# Altium project MB1189.PrjPCB (part 1 of 2)
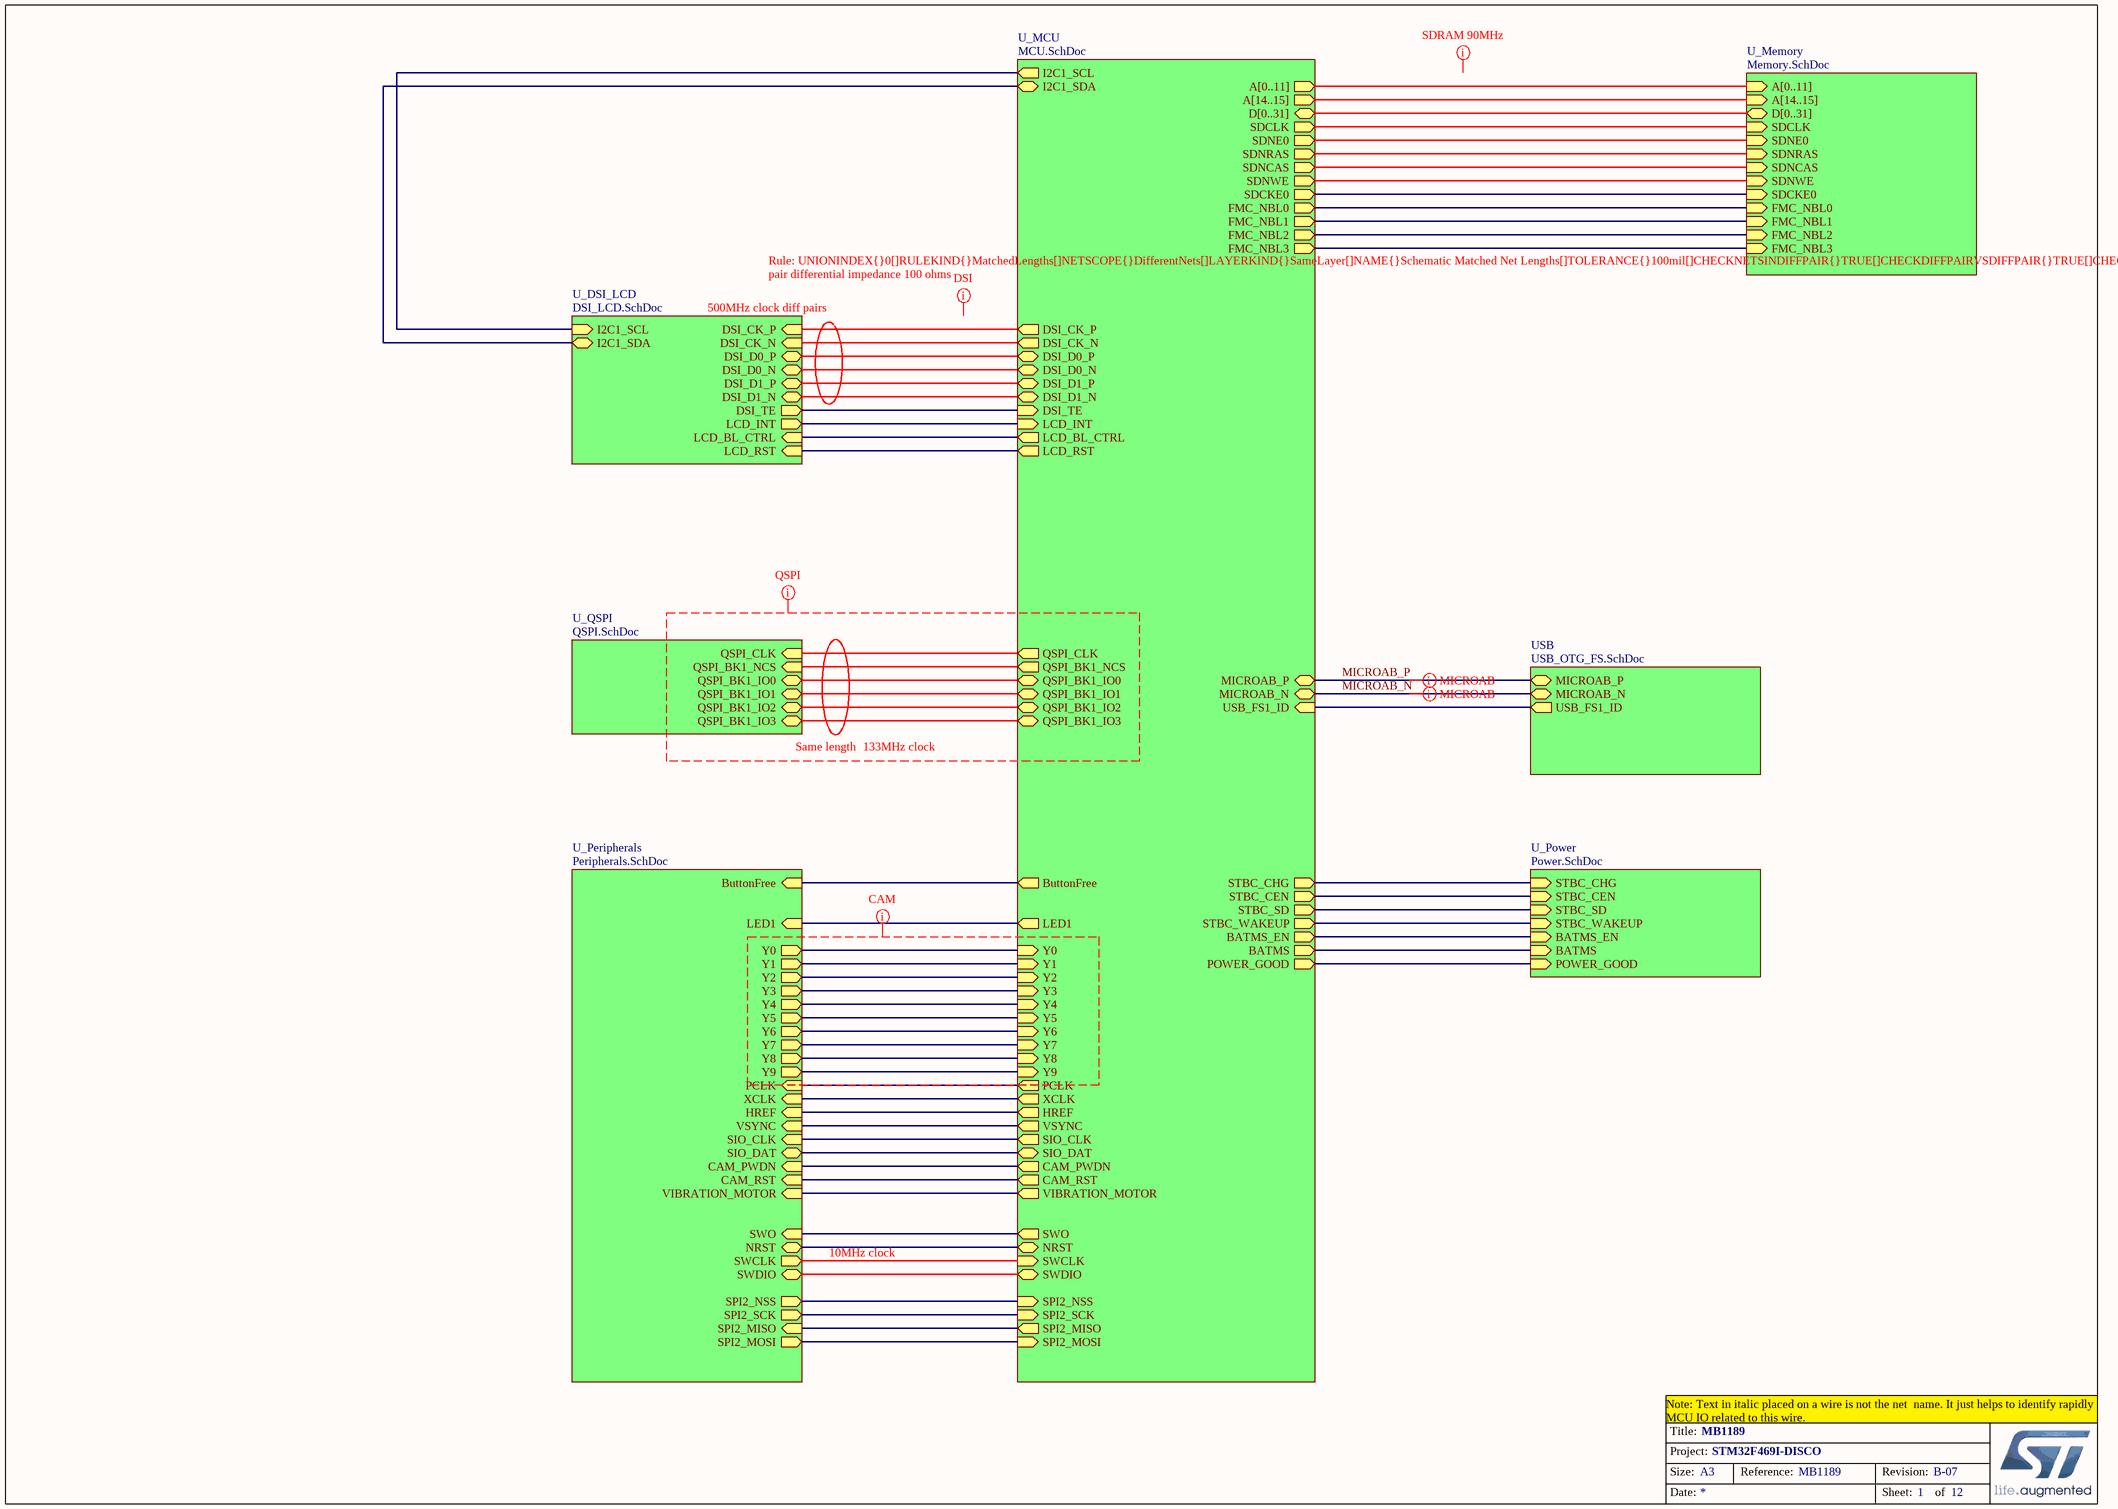
[diagram p0: MB1189.SchDoc]
8 sheets, 152 parts. Net scope: hierarchical (ports join the sheet entries above them; power ports are global).
Board files: MB1189.PcbDoc, trussy.PcbDoc
Sheets:
  MB1189.SchDoc
    U_Memory = Memory.SchDoc
    U_Peripherals = Peripherals.SchDoc
    U_Power = Power.SchDoc
    U_MCU = MCU.SchDoc
    U_DSI_LCD = DSI_LCD.SchDoc
    U_QSPI = QSPI.SchDoc
    USB = USB_OTG_FS.SchDoc

## Sheet MB1189.SchDoc: MB1189
size A3; Date: 9/24/2014; Author: P.A.; CompanyName: STMicroelectronics; Organization: Microcontrollers Division; Address1: 12, Rue Jules HOROWITZ; Address2: 38019 Grenoble; Address3: FRANCE; DocumentNumber: MB1189; Revision: B-07; SheetNumber: 1; SheetTotal: 12; Project: STM32F469I-DISCO

### Sub-sheets
U_DSI_LCD = DSI_LCD.SchDoc: DSI_CK_P (in), DSI_CK_N (in), DSI_D0_P (bidir), DSI_D0_N (bidir), DSI_D1_P (bidir), DSI_D1_N (bidir), DSI_TE (out), I2C1_SDA (bidir), I2C1_SCL (in), LCD_BL_CTRL (in), LCD_INT (out), LCD_RST (in)
U_MCU = MCU.SchDoc: LCD_BL_CTRL (out), I2C1_SCL (out), I2C1_SDA (bidir), FMC_NBL3 (out), FMC_NBL2 (out), FMC_NBL0 (out), FMC_NBL1 (out), SDNRAS (out), SDCLK (out), SDNCAS (out), SDCKE0 (out), SDNE0 (out), SDNWE (out), D[0..31] (bidir), QSPI_CLK (out), QSPI_BK1_NCS (out), QSPI_BK1_IO3 (bidir), QSPI_BK1_IO2 (bidir), QSPI_BK1_IO1 (bidir), QSPI_BK1_IO0 (bidir), DSI_TE (in), DSI_CK_P (out), DSI_CK_N (out), DSI_D0_P (bidir), DSI_D0_N (bidir), DSI_D1_P (bidir), DSI_D1_N (bidir), NRST (bidir), LCD_INT (in), LED1 (out), SWCLK (in), SWDIO, A[0..11] (out), A[14..15] (out), LCD_RST (out), STBC_CHG (out), STBC_CEN (out), STBC_WAKEUP (out), STBC_SD (out), BATMS (out), BATMS_EN (out), POWER_GOOD (out), Y0 (in), Y1 (in), Y2 (in), Y3 (in), Y4 (in), Y5 (in), Y6 (in), Y7 (in), Y8 (in), PCLK (out), VSYNC (out), XCLK (out), HREF (out), SIO_CLK (out), CAM_PWDN (out), SIO_DAT (bidir), VIBRATION_MOTOR (out), CAM_RST (out), MICROAB_P (bidir), MICROAB_N (bidir), USB_FS1_ID (in), SWO (out), Y9 (in), ButtonFree (out), SPI2_NSS (in), SPI2_MISO (out), SPI2_SCK (in), SPI2_MOSI (in)
U_Memory = Memory.SchDoc: FMC_NBL0 (in), FMC_NBL1 (in), D[0..31] (bidir), SDNCAS (in), SDNWE (in), SDNRAS (in), SDNE0 (in), SDCKE0 (in), SDCLK (in), FMC_NBL3 (in), FMC_NBL2 (in), A[0..11] (in), A[14..15] (in)
U_Peripherals = Peripherals.SchDoc: LED1 (in), Y0 (out), Y1 (out), Y2 (out), Y3 (out), Y4 (out), Y5 (out), Y6 (out), Y7 (out), Y8 (out), PCLK (in), VSYNC (in), XCLK (in), HREF (in), SIO_CLK (in), CAM_PWDN (in), SIO_DAT (bidir), VIBRATION_MOTOR (in), CAM_RST (in), SWDIO, SWCLK (out), NRST (bidir), SWO (in), Y9 (out), ButtonFree (in), SPI2_NSS (out), SPI2_MISO (in), SPI2_SCK (out), SPI2_MOSI (out)
U_Power = Power.SchDoc: STBC_CHG (in), STBC_CEN (in), STBC_WAKEUP (in), STBC_SD (in), BATMS (in), BATMS_EN (in), POWER_GOOD (in)
U_QSPI = QSPI.SchDoc: QSPI_BK1_IO0 (bidir), QSPI_BK1_IO2 (bidir), QSPI_BK1_IO1 (bidir), QSPI_CLK (in), QSPI_BK1_NCS (in), QSPI_BK1_IO3 (bidir)
USB = USB_OTG_FS.SchDoc: MICROAB_P (bidir), MICROAB_N (bidir), USB_FS1_ID (out)

### Nets
BATMS: sheet U_Power/BATMS, sheet U_MCU/BATMS
BATMS_EN: sheet U_Power/BATMS_EN, sheet U_MCU/BATMS_EN
CAM_PWDN: sheet U_Peripherals/CAM_PWDN, sheet U_MCU/CAM_PWDN
CAM_RST: sheet U_Peripherals/CAM_RST, sheet U_MCU/CAM_RST
DSI_CK_N: sheet U_MCU/DSI_CK_N, sheet U_DSI_LCD/DSI_CK_N
DSI_CK_P: sheet U_MCU/DSI_CK_P, sheet U_DSI_LCD/DSI_CK_P
DSI_D0_N: sheet U_MCU/DSI_D0_N, sheet U_DSI_LCD/DSI_D0_N
DSI_D0_P: sheet U_MCU/DSI_D0_P, sheet U_DSI_LCD/DSI_D0_P
DSI_D1_N: sheet U_MCU/DSI_D1_N, sheet U_DSI_LCD/DSI_D1_N
DSI_D1_P: sheet U_MCU/DSI_D1_P, sheet U_DSI_LCD/DSI_D1_P
DSI_TE: sheet U_MCU/DSI_TE, sheet U_DSI_LCD/DSI_TE
HREF: sheet U_Peripherals/HREF, sheet U_MCU/HREF
I2C1_SCL: sheet U_MCU/I2C1_SCL, sheet U_DSI_LCD/I2C1_SCL
I2C1_SDA: sheet U_MCU/I2C1_SDA, sheet U_DSI_LCD/I2C1_SDA
LCD_BL_CTRL: sheet U_MCU/LCD_BL_CTRL, sheet U_DSI_LCD/LCD_BL_CTRL
LCD_INT: sheet U_MCU/LCD_INT, sheet U_DSI_LCD/LCD_INT
LCD_RST: sheet U_MCU/LCD_RST, sheet U_DSI_LCD/LCD_RST
LED1: sheet U_Peripherals/LED1, sheet U_MCU/LED1
MICROAB_N: sheet U_MCU/MICROAB_N, sheet USB/MICROAB_N
MICROAB_P: sheet U_MCU/MICROAB_P, sheet USB/MICROAB_P
NRST: sheet U_Peripherals/NRST, sheet U_MCU/NRST
PB6: sheet U_MCU/QSPI_BK1_NCS, sheet U_QSPI/QSPI_BK1_NCS
PC0: sheet U_Memory/SDNWE, sheet U_MCU/SDNWE
PCLK: sheet U_Peripherals/PCLK, sheet U_MCU/PCLK
PE0: sheet U_Memory/FMC_NBL0, sheet U_MCU/FMC_NBL0
PE1: sheet U_Memory/FMC_NBL1, sheet U_MCU/FMC_NBL1
PF6: sheet U_MCU/QSPI_BK1_IO3, sheet U_QSPI/QSPI_BK1_IO3
PF7: sheet U_MCU/QSPI_BK1_IO2, sheet U_QSPI/QSPI_BK1_IO2
PF8: sheet U_MCU/QSPI_BK1_IO0, sheet U_QSPI/QSPI_BK1_IO0
PF9: sheet U_MCU/QSPI_BK1_IO1, sheet U_QSPI/QSPI_BK1_IO1
PF10: sheet U_MCU/QSPI_CLK, sheet U_QSPI/QSPI_CLK
PF11: sheet U_Memory/SDNRAS, sheet U_MCU/SDNRAS
PG15: sheet U_Memory/SDNCAS, sheet U_MCU/SDNCAS
PH2: sheet U_Memory/SDCKE0, sheet U_MCU/SDCKE0
PH3: sheet U_Memory/SDNE0, sheet U_MCU/SDNE0
PI4: sheet U_Memory/FMC_NBL2, sheet U_MCU/FMC_NBL2
PI5: sheet U_Memory/FMC_NBL3, sheet U_MCU/FMC_NBL3
POWER_GOOD: sheet U_Power/POWER_GOOD, sheet U_MCU/POWER_GOOD
SIO_CLK: sheet U_Peripherals/SIO_CLK, sheet U_MCU/SIO_CLK
SIO_DAT: sheet U_Peripherals/SIO_DAT, sheet U_MCU/SIO_DAT
SPI2_MISO: sheet U_Peripherals/SPI2_MISO, sheet U_MCU/SPI2_MISO
SPI2_MOSI: sheet U_Peripherals/SPI2_MOSI, sheet U_MCU/SPI2_MOSI
SPI2_NSS: sheet U_Peripherals/SPI2_NSS, sheet U_MCU/SPI2_NSS
SPI2_SCK: sheet U_Peripherals/SPI2_SCK, sheet U_MCU/SPI2_SCK
STBC_CEN: sheet U_Power/STBC_CEN, sheet U_MCU/STBC_CEN
STBC_CHG: sheet U_Power/STBC_CHG, sheet U_MCU/STBC_CHG
STBC_SD: sheet U_Power/STBC_SD, sheet U_MCU/STBC_SD
STBC_WAKEUP: sheet U_Power/STBC_WAKEUP, sheet U_MCU/STBC_WAKEUP
SWCLK: sheet U_Peripherals/SWCLK, sheet U_MCU/SWCLK
SWDIO: sheet U_Peripherals/SWDIO, sheet U_MCU/SWDIO
VIBRATION_MOTOR: sheet U_Peripherals/VIBRATION_MOTOR, sheet U_MCU/VIBRATION_MOTOR
VSYNC: sheet U_Peripherals/VSYNC, sheet U_MCU/VSYNC
XCLK: sheet U_Peripherals/XCLK, sheet U_MCU/XCLK
Y0: sheet U_Peripherals/Y0, sheet U_MCU/Y0
Y1: sheet U_Peripherals/Y1, sheet U_MCU/Y1
Y2: sheet U_Peripherals/Y2, sheet U_MCU/Y2
Y3: sheet U_Peripherals/Y3, sheet U_MCU/Y3
Y4: sheet U_Peripherals/Y4, sheet U_MCU/Y4
Y5: sheet U_Peripherals/Y5, sheet U_MCU/Y5
Y6: sheet U_Peripherals/Y6, sheet U_MCU/Y6
Y7: sheet U_Peripherals/Y7, sheet U_MCU/Y7
Y8: sheet U_Peripherals/Y8, sheet U_MCU/Y8
Y9: sheet U_Peripherals/Y9, sheet U_MCU/Y9
NetCN1_1: sheet U_Peripherals/SWO, sheet U_MCU/SWO
NetR8_2: sheet U_Peripherals/ButtonFree, sheet U_MCU/ButtonFree
NetR161_2: sheet U_MCU/USB_FS1_ID, sheet USB/USB_FS1_ID
NetU4_J1: sheet U_Memory/SDCLK, sheet U_MCU/SDCLK

### Buses and harness runs
bus sheet U_MCU/A[0..11] = sheet U_Memory/A[0..11]
bus sheet U_MCU/A[14..15] = sheet U_Memory/A[14..15]
bus sheet U_MCU/D[0..31] = sheet U_Memory/D[0..31]

### Layout directives
mark named SDRAM 90MHz: (no net found under the mark)
rule Matched Net Lengths [Tolerance = 100mil]; rule ? : (no net found under the mark)
differential pair: MICROAB_N, MICROAB_P
net class Cam: (no net found under the mark)
net class QSPI: (no net found under the mark)

### Notes on the sheet
- 500MHz clock diff pairs
- Same length
- 133MHz clock
- 10MHz clock
- Note: Text in italic placed on a wire is not the net  name. It just helps to identify rapidly MCU IO related to this wire.
- Title:
- Project:
- Size:
- Date:
- A3
- Reference:
- Sheet:
- Revision:
- of

## Sheet Memory.SchDoc: SDRAM
size A4; Date: 9/24/2014; Author: P.A.; CompanyName: STMicroelectronics; Organization: Microcontrollers Division; Address1: 12, Rue Jules HOROWITZ; Address2: 38019 Grenoble; Address3: FRANCE; DocumentNumber: MB1189; Revision: B-07; SheetNumber: 8; SheetTotal: 12; Project: STM32F469I-DISCO
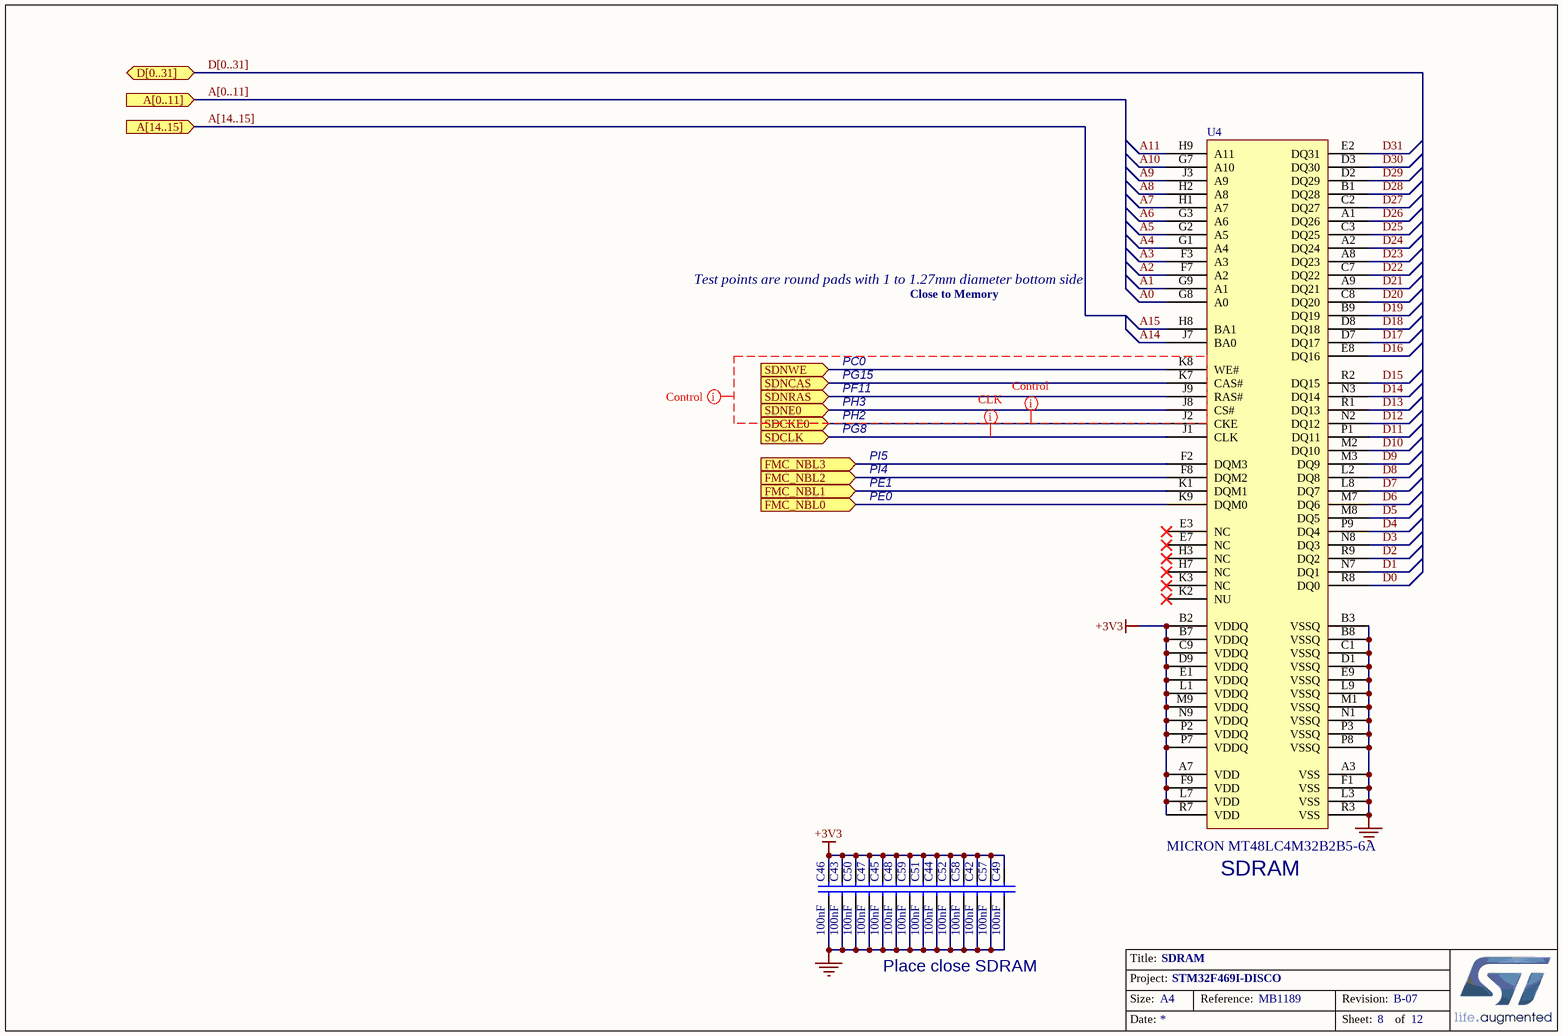
[diagram p1: Memory.SchDoc]

### Parts
C42  100nF  [CAP - 0402]
C43  100nF  [CAP - 0402]
C44  100nF  [CAP - 0402]
C45  100nF  [CAP - 0402]
C46  100nF  [CAP - 0402]
C47  100nF  [CAP - 0402]
C48  100nF  [CAP - 0402]
C49  100nF  [CAP - 0402]
C50  100nF  [CAP - 0402]
C51  100nF  [CAP - 0402]
C52  100nF  [CAP - 0402]
C57  100nF  [CAP - 0402]
C58  100nF  [CAP - 0402]
C59  100nF  [CAP - 0402]
U4  MICRON MT48LC4M32B2B5-6A  [MICT-B5-90]

### Ports
A[0..11] (in), A[14..15] (in), D[0..31] (bidir), FMC_NBL0 (in), FMC_NBL1 (in), FMC_NBL2 (in), FMC_NBL3 (in), SDCKE0 (in), SDCLK (in), SDNCAS (in), SDNE0 (in), SDNRAS (in), SDNWE (in)

### Nets
+3V3: C42.1 C43.1 C44.1 C45.1 C46.1 C47.1 C48.1 C49.1 C50.1 C51.1 C52.1 C57.1 C58.1 C59.1 U4.A7(VDD) U4.B2(VDDQ) U4.B7(VDDQ) U4.C9(VDDQ) U4.D9(VDDQ) U4.E1(VDDQ) U4.F9(VDD) U4.L1(VDDQ) U4.L7(VDD) U4.M9(VDDQ) U4.N9(VDDQ) U4.P2(VDDQ) U4.P7(VDDQ) U4.R7(VDD)
GND: C42.2 C43.2 C44.2 C45.2 C46.2 C47.2 C48.2 C49.2 C50.2 C51.2 C52.2 C57.2 C58.2 C59.2 U4.A3(VSS) U4.B3(VSSQ) U4.B8(VSSQ) U4.C1(VSSQ) U4.D1(VSSQ) U4.E9(VSSQ) U4.F1(VSS) U4.L3(VSS) U4.L9(VSSQ) U4.M1(VSSQ) U4.N1(VSSQ) U4.P3(VSSQ) U4.P8(VSSQ) U4.R3(VSS)
A0: U4.G8(A0)
A1: U4.G9(A1)
A2: U4.F7(A2)
A3: U4.F3(A3)
A4: U4.G1(A4)
A5: U4.G2(A5)
A6: U4.G3(A6)
A7: U4.H1(A7)
A8: U4.H2(A8)
A9: U4.J3(A9)
A10: U4.G7(A10)
A11: U4.H9(A11)
A14: U4.J7(BA0)
A15: U4.H8(BA1)
D0: U4.R8(DQ0)
D1: U4.N7(DQ1)
D2: U4.R9(DQ2)
D3: U4.N8(DQ3)
D4: U4.P9(DQ4)
D5: U4.M8(DQ5)
D6: U4.M7(DQ6)
D7: U4.L8(DQ7)
D8: U4.L2(DQ8)
D9: U4.M3(DQ9)
D10: U4.M2(DQ10)
D11: U4.P1(DQ11)
D12: U4.N2(DQ12)
D13: U4.R1(DQ13)
D14: U4.N3(DQ14)
D15: U4.R2(DQ15)
D16: U4.E8(DQ16)
D17: U4.D7(DQ17)
D18: U4.D8(DQ18)
D19: U4.B9(DQ19)
D20: U4.C8(DQ20)
D21: U4.A9(DQ21)
D22: U4.C7(DQ22)
D23: U4.A8(DQ23)
D24: U4.A2(DQ24)
D25: U4.C3(DQ25)
D26: U4.A1(DQ26)
D27: U4.C2(DQ27)
D28: U4.B1(DQ28)
D29: U4.D2(DQ29)
D30: U4.D3(DQ30)
D31: U4.E2(DQ31)
PC0: U4.K8(WE#) ; port SDNWE
PE0: U4.K9(DQM0) ; port FMC_NBL0
PE1: U4.K1(DQM1) ; port FMC_NBL1
PF11: U4.J9(RAS#) ; port SDNRAS
PG15: U4.K7(CAS#) ; port SDNCAS
PH2: U4.J2(CKE) ; port SDCKE0
PH3: U4.J8(CS#) ; port SDNE0
PI4: U4.F8(DQM2) ; port FMC_NBL2
PI5: U4.F2(DQM3) ; port FMC_NBL3
NetU4_J1: U4.J1(CLK) ; port SDCLK

Not connected (* = marked no-connect by the designer): U4 E3(NC)* E7(NC)* H3(NC)* H7(NC)* K2(NU)* K3(NC)*

### Buses and harness runs
bus A[0..11] = port A[0..11]
bus A[14..15] = port A[14..15]
bus D[0..31] = port D[0..31]

### Layout directives
net class Control: (no net found under the mark), PH2
net class CLK: NetU4_J1

### Notes on the sheet
- (near U4) Test points are round pads with 1 to 1.27mm diameter bottom side
- Close to Memory
- PC0
- PG15
- PF11
- PH3
- PH2
- PG8
- PE1
- PE0
- PI5
- PI4
- (near U4) SDRAM
- Place close SDRAM
- Title:
- Project:
- Size:
- Date:
- A4
- Reference:
- Sheet:
- Revision:
- of

### Library data of the parts
C42-C52 C57-C59 = Cap: Capacitor; Value: 10nF; Ordered by: Subcon; Published: 8-Jun-2000; Revision: July-2002: Re-released for DXP Platform.; Publisher: Altium Limited
U4 = MT48LC4M32B2B5: Ordered by: Subcon; ECCN_US/EU: EAR99/NEC; Manuf_1: MICRON; Manuf_Part_1: MT48LC4M32B2B5-6A

## Sheet Peripherals.SchDoc: Peripherals
size A4; Date: 9/24/2014; Author: P.A.; CompanyName: STMicroelectronics; Organization: Microcontrollers Division; Address1: 12, Rue Jules HOROWITZ; Address2: 38019 Grenoble; Address3: FRANCE; DocumentNumber: MB1189; Revision: B-07; SheetNumber: 5; SheetTotal: 12; Project: STM32F469I-DISCO
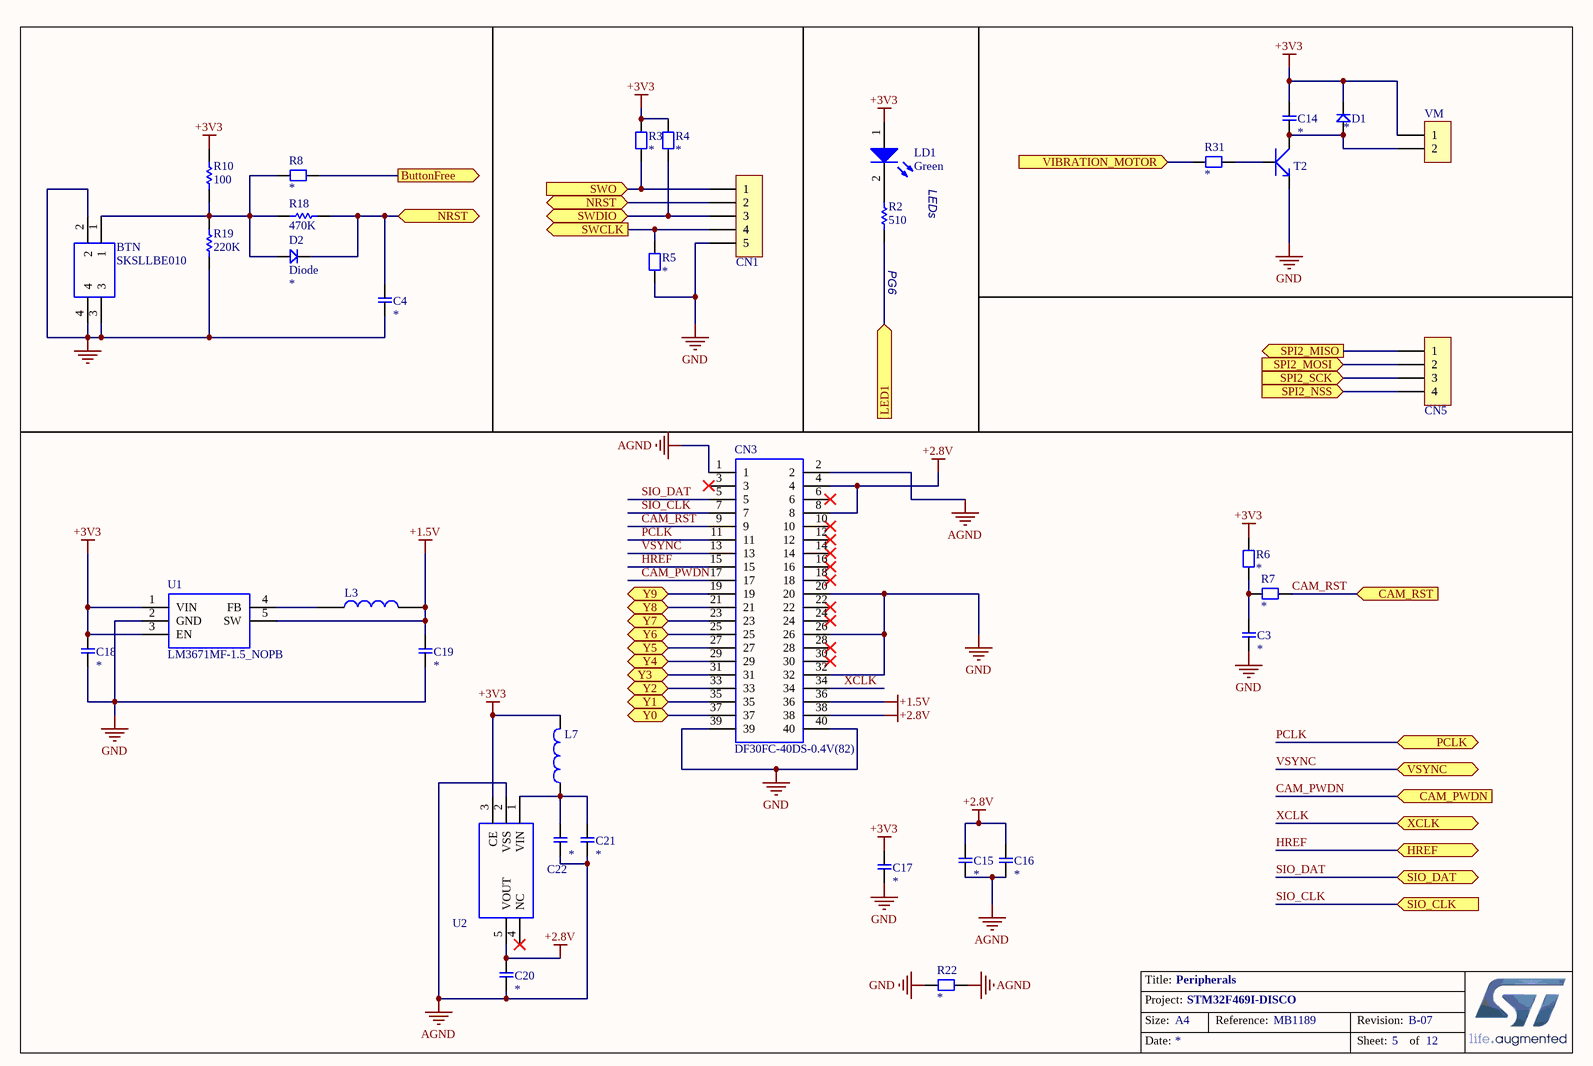
[diagram p2: Peripherals.SchDoc]

### Parts
BTN  SKSLLBE010  [SKSLLBE010]
C3  100 nF  [CAP - 0402]  (value not drawn)
C4  10uF  [CAP - 0805]  (value not drawn)
C14  100nF  [CAP - 0402]  (value not drawn)
C15  100nF  [CAP - 0402]  (value not drawn)
C16  100nF  [CAP - 0402]  (value not drawn)
C17  100nF  [CAP - 0402]  (value not drawn)
C18  4.7 uF  [CAP - 0603]  (value not drawn)
C19  10 uF  [CAP - 0402]  (value not drawn)
C20  1uF  [CAP - 0402]  (value not drawn)
C21  100nF  [CAP - 0402]  (value not drawn)
C22  10uF  [CAP - 0402]  (value not drawn)
CN1  Pin header 5p  [PIN HEADER 5P 2.54mm]  (value not drawn)
CN3  DF30FC-40DS-0.4V(82)  [DF30FC40DS04V82]
CN5  Pin header 4p  [Pin header 4p 1.27mm]  (value not drawn)
D1  Diode  [SOD123]  (value not drawn)
D2  Diode  [SOD123]
L3  2.2uH  [INDPM4532X280N]  (value not drawn)
L7  BEAD(BK1608HS600-T)  [1608[0603]]  (value not drawn)
LD1  Green  [LEDC1608X55N]
R2  510  [RES - 0402]
R3  4K7  [RES - 0402]  (value not drawn)
R4  4K7  [RES - 0402]  (value not drawn)
R5  47K  [RES - 0402]  (value not drawn)
R6  4K7  [RES - 0402]  (value not drawn)
R7  0R  [RES - 0402]  (value not drawn)
R8  10  [RES - 0402]  (value not drawn)
R10  100  [RES - 0402]
R18  470K  [RES - 0603]
R19  220K  [RES - 0402]
R22  0R  [RES - 0402]  (value not drawn)
R31  1K  [RES - 0402]  (value not drawn)
T2  BC817  [SOT23]  (value not drawn)
U1  LM3671MF-1.5_NOPB  [SOT95P280X145-5N]
U2  AP7365-28WG-7DICT-ND  [SOT95P280X120-5N]  (value not drawn)
VM  Pin header 2p  [RES - 0603]  (value not drawn)

### Ports
ButtonFree (out), CAM_PWDN (in), CAM_RST (in), HREF, LED1 (in), NRST (bidir), PCLK, SIO_CLK (in), SIO_DAT (bidir), SPI2_MISO (out), SPI2_MOSI (in), SPI2_NSS (in), SPI2_SCK (in), SWCLK (out), SWDIO (bidir), SWO (in), VIBRATION_MOTOR (in), VSYNC, XCLK, Y0, Y1, Y2, Y3, Y4, Y5, Y6, Y7, Y8, Y9

### Nets
+1.5V: C19.2 CN3.36 L3.2 U1.5(SW)
+2.8V: C15.1 C16.1 C20.1 CN3.4 CN3.8 CN3.38 U2.5(VOUT)
+3V3: C14.2 C17.1 C18.2 D1.2 L7.2 LD1.1(A) R3.2 R4.2 R6.2 R10.2 U1.1(VIN) U1.3(EN) U2.3(CE) VM.1
AGND: C15.2 C16.2 C20.2 C21.2 C22.2 CN3.1 CN3.2 R22.1 U2.2(VSS)
GND: BTN.2 BTN.3 BTN.4 C3.2 C4.1 C17.2 C18.1 C19.1 CN1.5 CN3.20 CN3.26 CN3.32 CN3.39 CN3.40 R5.1 R19.2 R22.2 T2.2 U1.2(GND)
CAM_PWDN: CN3.17 ; port CAM_PWDN
CAM_RST: CN3.9 R7.1 ; port CAM_RST
HREF: CN3.15 ; port HREF
LED1: R2.1 ; port LED1
NRST: C4.2 CN1.2 D2.2 R18.2 ; port NRST
PCLK: CN3.11 ; port PCLK
SIO_CLK: CN3.7 ; port SIO_CLK
SIO_DAT: CN3.5 ; port SIO_DAT
SPI2_MISO: CN5.1 ; port SPI2_MISO
SPI2_MOSI: CN5.2 ; port SPI2_MOSI
SPI2_NSS: CN5.4 ; port SPI2_NSS
SPI2_SCK: CN5.3 ; port SPI2_SCK
SWCLK: CN1.4 R5.2 ; port SWCLK
SWDIO: CN1.3 R4.1 ; port SWDIO
VIBRATION_MOTOR: R31.2 ; port VIBRATION_MOTOR
VSYNC: CN3.13 ; port VSYNC
XCLK: CN3.34 ; port XCLK
Y0: CN3.37 ; port Y0
Y1: CN3.35 ; port Y1
Y2: CN3.33 ; port Y2
Y3: CN3.31 ; port Y3
Y4: CN3.29 ; port Y4
Y5: CN3.27 ; port Y5
Y6: CN3.25 ; port Y6
Y7: CN3.23 ; port Y7
Y8: CN3.21 ; port Y8
Y9: CN3.19 ; port Y9
NetBTN_1: BTN.1 D2.1 R8.1 R10.1 R18.1 R19.1
NetC3_1: C3.1 R6.1 R7.2
NetC14_1: C14.1 D1.1 T2.3 VM.2
NetC21_1: C21.1 C22.1 L7.1 U2.1(VIN)
NetCN1_1: CN1.1 R3.1 ; port SWO
NetL3_1: L3.1 U1.4(FB)
NetLD1_2: LD1.2(K) R2.2
NetR8_2: R8.2 ; port ButtonFree
NetR31_1: R31.1 T2.1

Not connected (* = marked no-connect by the designer): CN3 3* 6* 10* 12* 14* 16* 18* 22* 24* 28* 30*; U2 4(NC)*

### Notes on the sheet
- LEDs
- (near R2) PG6
- Title:
- Project:
- Size:
- Date:
- A4
- Reference:
- Sheet:
- Revision:
- of

### Library data of the parts
BTN = SKSLLBE010: Black Button Tactile Switch, SPST-NO 50 mA 0.5mm Surface Mount; Manufacturer_Name: ALPS; Geometry.Height: 2mm; Mouser Part Number: 688-SKSLLBE010; Manufacturer_Part_Number: SKSLLBE010; Datasheet Link: https://componentsearchengine.com/Datasheets/1/SKSLLBE010.pdf
C3 C4 C14-C22 = capacitor: Parameter 1: *; Parameter 2: *; Value: *
CN3 = DF30FC-40DS-0.4V(82): Hirose DF30 Series 0.4mm 40 Way 2 Row Straight PCB Socket Surface Mount Board to Board, Board to FPC; Geometry.Height: 1.05mm; Manufacturer_Name: Hirose; Manufacturer_Part_Number: DF30FC-40DS-0.4V(82); RS Part Number: 7008159; RS Price/Stock: http://uk.rs-online.com/web/p/products/7008159; Arrow Part Number: DF30FC-40DS-0.4V(82); Arrow Price/Stock: http://uk.rs-online.com/web/p/products/7008159; Datasheet Link: https://www.hirose.com/product/en/download_file/key_name/DF30FC-40DS-0.4V%2882%29/category/Drawing%20(2D)/doc_file_id/46399/?file_category_id=6&item_id=06841078682&is_series=
L3 = LQH43CN100K03L: 587-3550-1-ND; Manufacturer_Name: Murata Electronics; Geometry.Height: 2.8mm; Manufacturer_Part_Number: LQH43CN100K03L; RS Part Number: 7255165P; RS Price/Stock: http://uk.rs-online.com/web/p/products/7255165P; Arrow Part Number: LQH43CN100K03L; Arrow Price/Stock: https://www.arrow.com/en/products/lqh43cn100k03l/murata-manufacturing; Datasheet Link: http://search.murata.co.jp/Ceramy/image/img/PDF/ENG/L0075S0093LQH43C_03.pdf
L7 = Inductor: Code_IEC: 1005; Value: 10mH; Published: 8-Jun-2000; LatestRevisionDate: 29-May-2009; LatestRevisionNote: IPC-7351 Footprint Added.; PackageReference: 0402-A; Publisher: Altium Limited; PackageDescription: Chip Inductor; Code_JEITA: 0402
LD1 = LED2: Typical RED, GREEN, YELLOW, AMBER GaAs LED; Ordered by: Subcon; ECCN_US/EU: EAR99/NEC; Published: 8-Jun-2000; Revision: July-2002: Re-released for DXP Platform.; Publisher: Altium Limited
R2 R10 R18 = Res1: Resistor; Value: 1K; Ordered by: Subcon; Published: 8-Jun-2000; Revision: July-2002: Re-released for DXP Platform.; Publisher: Altium Limited
R3-R8 R22 R31 = resistor: Parameter 1: *; Parameter 2: *; Value: *
R19 = res1: Resistor; Value: 1K; Ordered by: Subcon; Published: 8-Jun-2000; Revision: July-2002: Re-released for DXP Platform.; Publisher: Altium Limited
U1 = LM3671MF-1.5_NOPB: 2MHz, 600mA Step-Down DC-DC Converter; Manufacturer_Name: Texas Instruments; Manufacturer_Part_Number: LM3671MF-1.5/NOPB; Geometry.Height: 1.45mm; RS Part Number: 1624720; RS Price/Stock: http://uk.rs-online.com/web/p/products/1624720; Arrow Part Number: LM3671MF-1.5/NOPB; Arrow Price/Stock: https://www.arrow.com/en/products/lm3671mf-1.5nopb/texas-instruments; Datasheet Link: http://www.ti.com/lit/ds/symlink/lm3671.pdf
U2 = XC6210B302MR-G: LDO Voltage Regulators 700mA High Speed Votage Regulator; Manufacturer_Name: Torex; Geometry.Height: 1.2mm; Manufacturer_Part_Number: XC6210B302MR-G; RS Part Number: *; RS Price/Stock: *; Arrow Part Number: XC6210B302MR-G; Arrow Price/Stock: *; Datasheet Link: https://componentsearchengine.com/Datasheets/1/XC6210B302MR-G.pdf
D1 D2 = Diode: Type: *

## Sheet Power.SchDoc: Power
size A4; Date: 9/24/2014; Author: P.A.; CompanyName: STMicroelectronics; Organization: Microcontrollers Division; Address1: 12, Rue Jules HOROWITZ; Address2: 38019 Grenoble; Address3: FRANCE; DocumentNumber: MB1189; Revision: B-07; SheetNumber: 4; SheetTotal: 12; Project: STM32F469I-DISCO
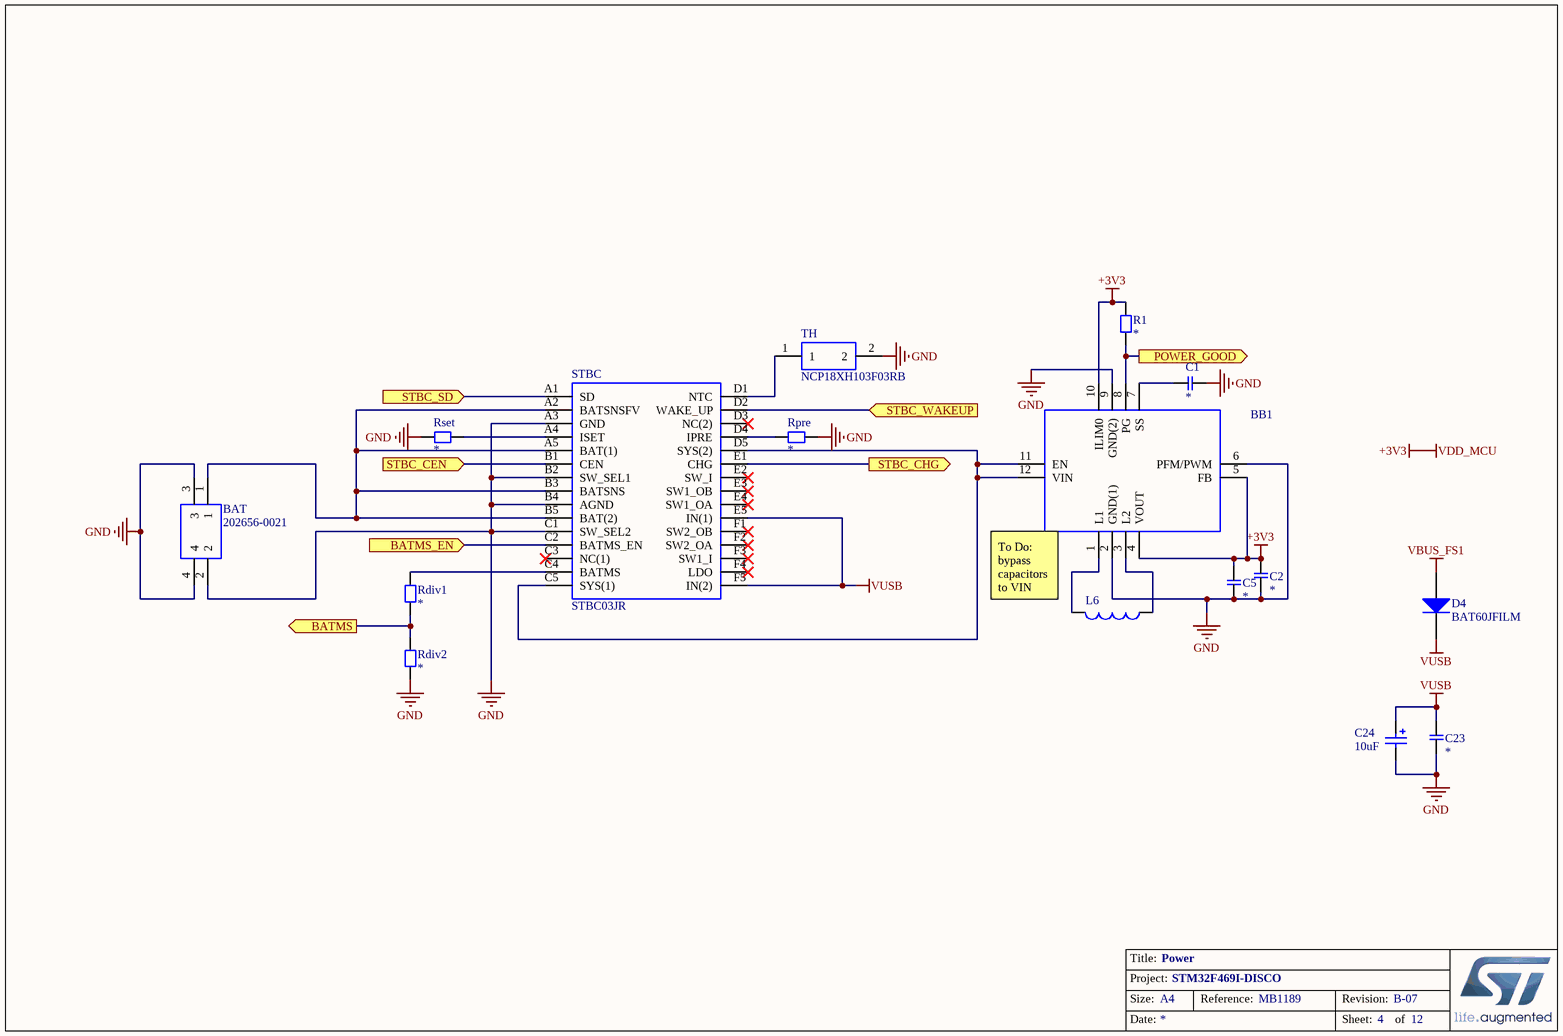
[diagram p3: Power.SchDoc]

### Parts
BAT  202656-0021  [2026560021]
BB1  TPS63051RMWT  [QFN50P250X250X100-12N-D]  (value not drawn)
C1  1nF  [CAP - 0402]  (value not drawn)
C2  10uF  [CAP - 0402]  (value not drawn)
C5  100nF  [CAP - 0402]  (value not drawn)
C23  10uF  [CAP - 0402]  (value not drawn)
C24  10uF  [A]
D4  BAT60JFILM  [SOD323]
L6  1269AS-H-1R5M=P2  [INDC2928X203N]  (value not drawn)
R1  1M  [RES - 1206]  (value not drawn)
Rdiv1  100k  [RES - 0402]  (value not drawn)
Rdiv2  200K  [RES - 0402]  (value not drawn)
Rpre  1K  [RES - 0402]  (value not drawn)
Rset  430 Ohm  [RES - 0402]  (value not drawn)
STBC  STBC03JR  [BGA30C40P5X6_225X259X60]
TH  NCP18XH103F03RB  [THRMC1608X95N]

### Ports
BATMS (out), BATMS_EN (in), POWER_GOOD (out), STBC_CEN (in), STBC_CHG (out), STBC_SD (in), STBC_WAKEUP (in)

### Nets
+3V3: BB1.4(VOUT) BB1.5(FB) BB1.10(ILIM0) C2.1 C5.1 R1.1  [also labelled VDD_MCU]
GND: BAT.2 BAT.3 BAT.4 BB1.2(GND(1)) BB1.6(PFM/PWM) BB1.9(GND(2)) C1.2 C2.2 C5.2 C23.2 C24.2 Rdiv2.1 Rpre.1 Rset.2 STBC.A3(GND) STBC.B2(SW_SEL1) STBC.B4(AGND) STBC.C1(SW_SEL2) TH.2
VBUS_FS1: D4.1(A)
VUSB: C23.1 C24.1 D4.2(K) STBC.E5(IN(1)) STBC.F5(IN(2))
BATMS: Rdiv1.1 Rdiv2.2 ; port BATMS
BATMS_EN: STBC.C2(BATMS_EN) ; port BATMS_EN
POWER_GOOD: BB1.8(PG) R1.2 ; port POWER_GOOD
STBC_CEN: STBC.B1(CEN) ; port STBC_CEN
STBC_CHG: STBC.E1(CHG) ; port STBC_CHG
STBC_SD: STBC.A1(SD) ; port STBC_SD
STBC_WAKEUP: STBC.D2(WAKE_UP) ; port STBC_WAKEUP
NetBAT_1: BAT.1 STBC.A2(BATSNSFV) STBC.A5(BAT(1)) STBC.B3(BATSNS) STBC.B5(BAT(2))
NetBB1_1: BB1.1(L1) L6.2
NetBB1_3: BB1.3(L2) L6.1
NetBB1_7: BB1.7(SS) C1.1
NetBB1_11: BB1.11(EN) BB1.12(VIN) STBC.C5(SYS(1)) STBC.D5(SYS(2))
NetRdiv1_2: Rdiv1.2 STBC.C4(BATMS)
NetRpre_2: Rpre.2 STBC.D4(IPRE)
NetRset_1: Rset.1 STBC.A4(ISET)
NetSTBC_D1: STBC.D1(NTC) TH.1

Not connected (* = marked no-connect by the designer): STBC C3(NC(1))* D3(NC(2))* E2(SW_I)* E3(SW1_OB)* E4(SW1_OA)* F1(SW2_OB)* F2(SW2_OA)* F3(SW1_I)* F4(LDO)*

### Notes on the sheet
- (near BB1) To Do: bypass capacitors to VIN
- Title:
- Project:
- Size:
- Date:
- A4
- Reference:
- Sheet:
- Revision:
- of

### Library data of the parts
BAT = 202656-0021: MOLEX - 202656-0021 - PLUG HOUSING, 2POS, NYLON, BLACK; Geometry.Height: 1mm; Manufacturer_Name: Molex; Manufacturer_Part_Number: 202656-0021; RS Part Number: *; RS Price/Stock: *; Mouser Part Number: 538-202656-0021; Mouser Price/Stock: https://www.mouser.com/Search/Refine.aspx?Keyword=538-202656-0021; Datasheet Link: https://www.molex.com/webdocs/datasheets/pdf/en-us/2026560021_PCB_HEADERS.pdf
BB1 = TPS63051RMWT: Switching Voltage Regulators Tiny Single Ind Buck Boost Convter; Manufacturer_Name: Texas Instruments; Geometry.Height: 1mm; Manufacturer_Part_Number: TPS63051RMWT; RS Part Number: *; RS Price/Stock: *; Datasheet Link: http://www.ti.com/general/docs/lit/getliterature.tsp?genericPartNumber=TPS63051&&fileType=pdf
C1 C2 C5 C23 = capacitor: Parameter 1: *; Parameter 2: *; Value: *
C24 = Cap Pol1: Polarized Capacitor (Radial); Ordered by: Subcon; Published: 8-Jun-2000; Revision: July-2002: Re-released for DXP Platform.; Publisher: Altium Limited; Value: 10uF
D4 = BAT60JFILM: Provided: ST; ECCN_US/EU: EAR99/NEC; Ref St: 9151097; Revision: July-2002: Re-released for DXP Platform.; Order: BAT60JFILM; Manuf_Part_1: BAT60JFILM; Manuf_1: ST; Distrib: ST; Ordered by: ST
L6 = Inductor: Code_IEC: 1005; Value: 10mH; Published: 8-Jun-2000; LatestRevisionDate: 29-May-2009; LatestRevisionNote: IPC-7351 Footprint Added.; PackageReference: 0402-A; Publisher: Altium Limited; PackageDescription: Chip Inductor; Code_JEITA: 0402
R1 Rdiv1 Rdiv2 Rpre Rset = resistor: Parameter 1: *; Parameter 2: *; Value: *
STBC = STBC03JR: STMICROELECTRONICS - STBC03JR - BATTERY CHARGER, LI-ION/POL, FLIPCHIP-30; Geometry.Height: 0.6mm; Manufacturer_Name: STMicroelectronics; Manufacturer_Part_Number: STBC03JR; RS Part Number: *; RS Price/Stock: *; Datasheet Link: http://www.st.com/content/ccc/resource/technical/document/datasheet/group3/05/ea/e8/4e/a7/a6/4a/c6/DM00338132/files/DM00338132.pdf/jcr:content/translations/en.DM00338132.pdf
TH = NCP18XH103F03RB: Thermistor NTC 10K Ohm 1% 2-Pin 0603 Surface Mount Solder Pad 3434K T/R; Manufacturer_Name: Murata Electronics; Geometry.Height: 0.95mm; Manufacturer_Part_Number: NCP18XH103F03RB; RS Part Number: 7259057P; RS Price/Stock: http://uk.rs-online.com/web/p/products/7259057P; Mouser Part Number: 81-NCP18XH103F03RB; Mouser Price/Stock: https://www.mouser.com/Search/Refine.aspx?Keyword=81-NCP18XH103F03RB; Datasheet Link: https://componentsearchengine.com/Datasheets/2/NCP18XH103F03RB.pdf

## Sheet MCU.SchDoc: MCU
size A3; Date: 9/24/2014; Author: P.A.; CompanyName: STMicroelectronics; Organization: Microcontrollers Division; Address1: 12, Rue Jules HOROWITZ; Address2: 38019 Grenoble; Address3: FRANCE; DocumentNumber: MB1189; Revision: B-07; SheetNumber: 2; SheetTotal: 12; Project: STM32F469I-DISCO
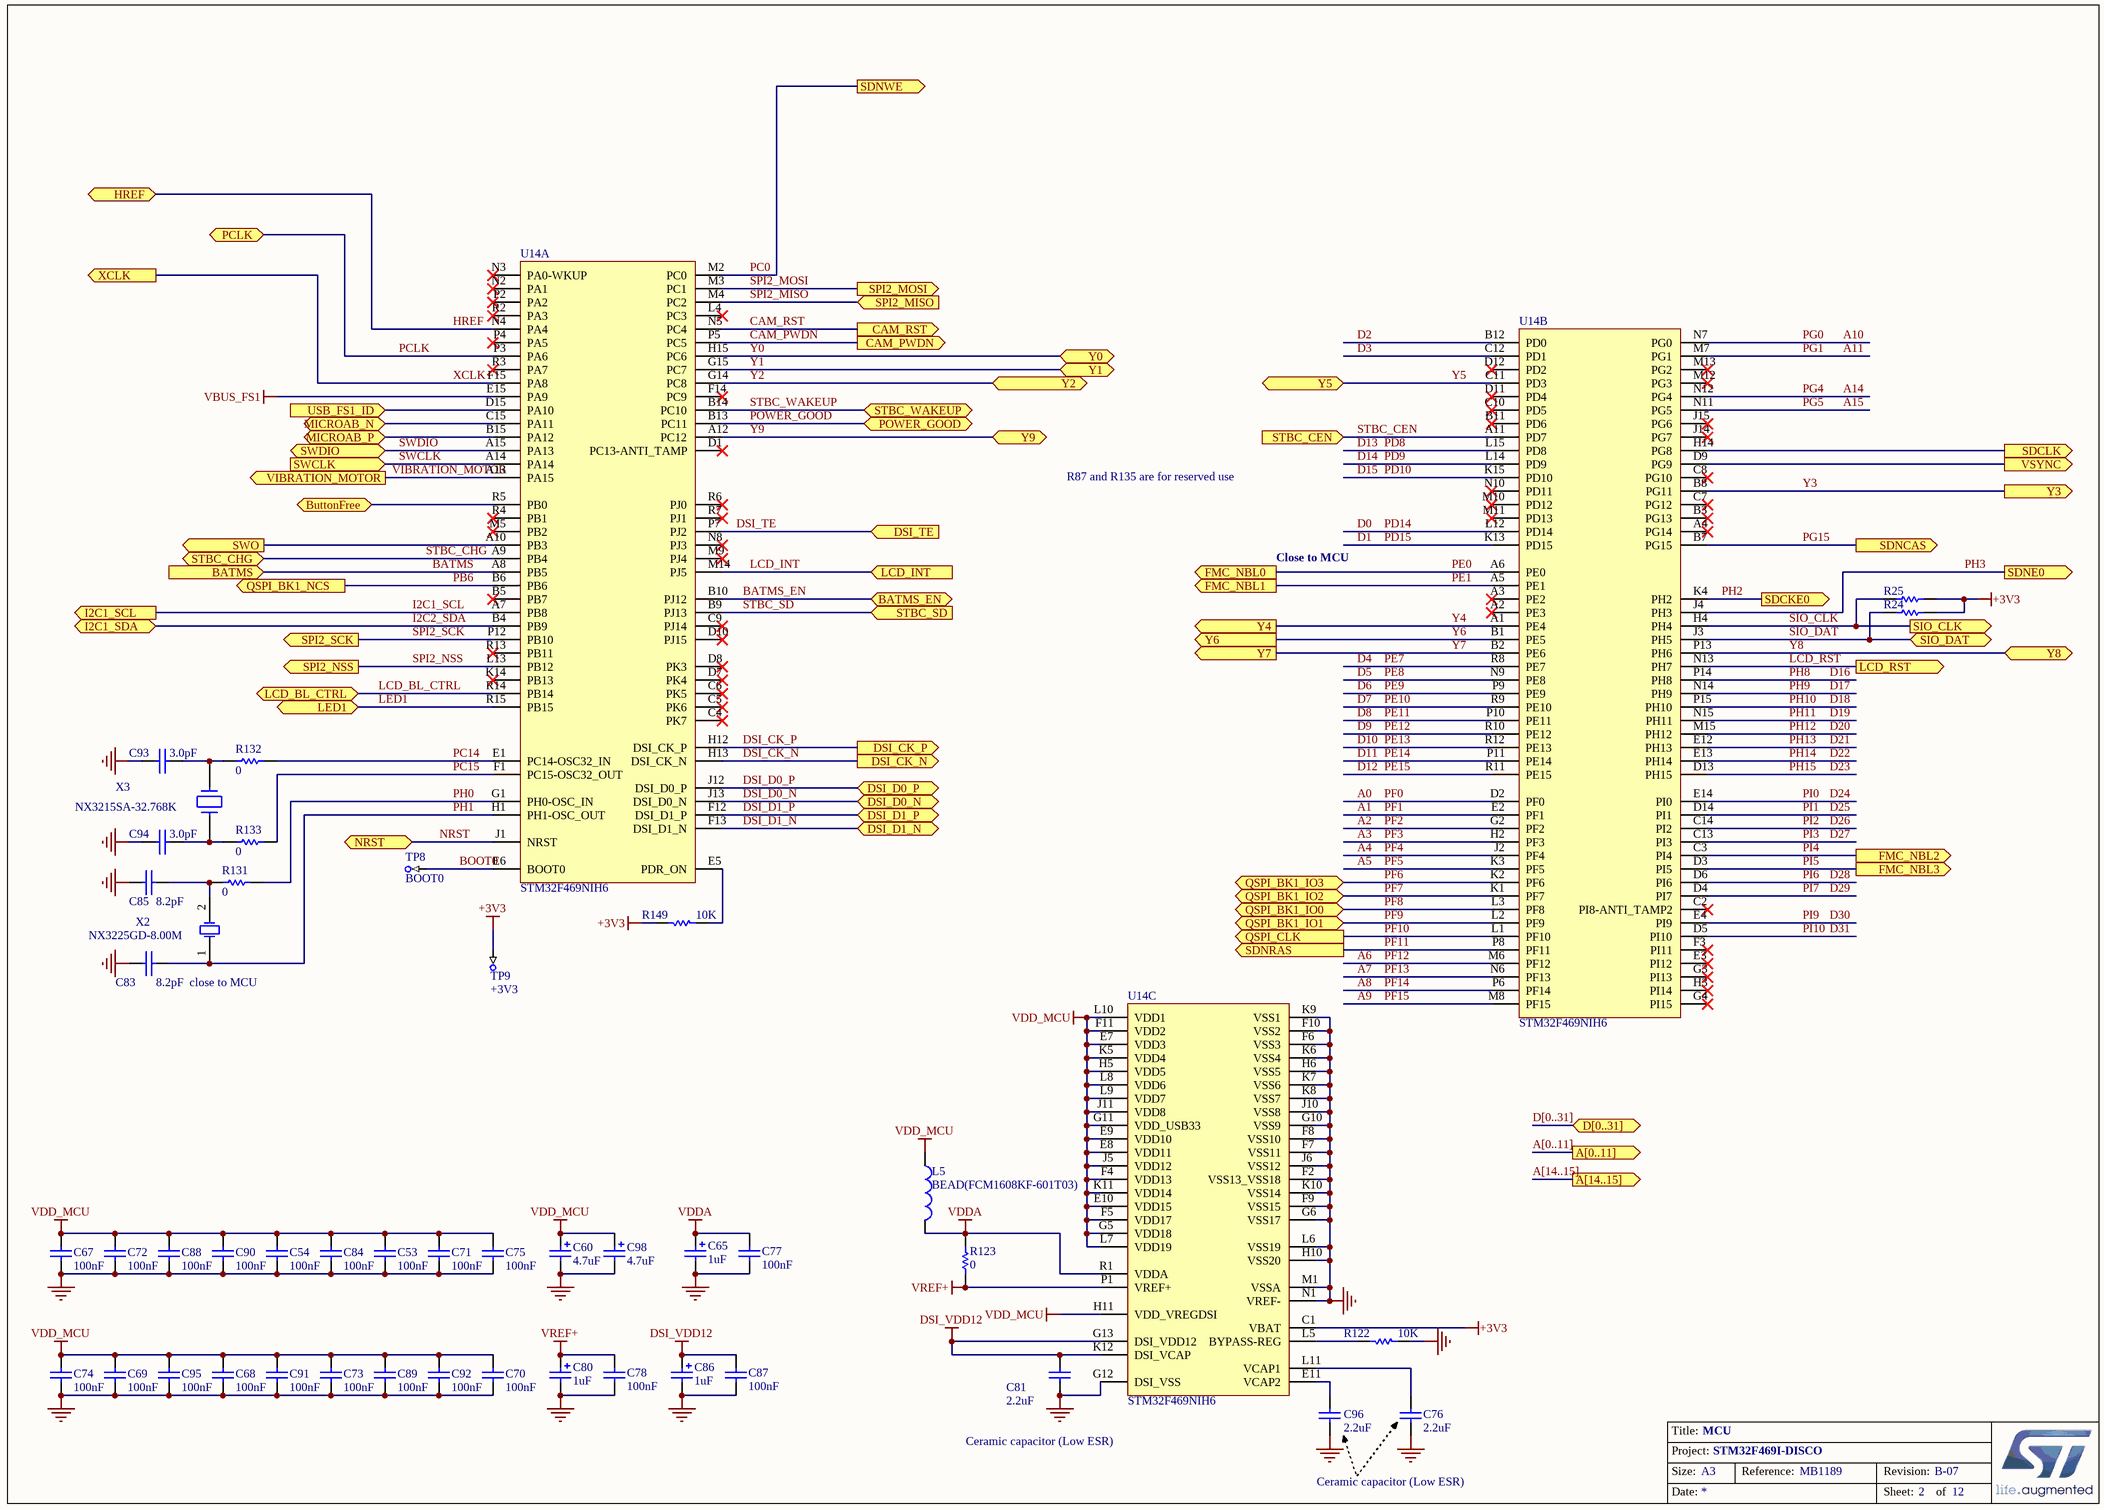
[diagram p4: MCU.SchDoc]

### Parts
C53  100nF  [CAP - 0402]
C54  100nF  [CAP - 0402]
C60  4.7uF  [A]
C65  1uF  [A]
C67  100nF  [CAP - 0402]
C68  100nF  [CAP - 0402]
C69  100nF  [CAP - 0402]
C70  100nF  [CAP - 0402]
C71  100nF  [CAP - 0402]
C72  100nF  [CAP - 0402]
C73  100nF  [CAP - 0402]
C74  100nF  [CAP - 0402]
C75  100nF  [CAP - 0402]
C76  2.2uF  [CAP - 0402]
C77  100nF  [CAP - 0402]
C78  100nF  [CAP - 0402]
C80  1uF  [A]
C81  2.2uF  [CAP - 0402]
C83  8.2pF  [CAP - 0603]
C84  100nF  [CAP - 0402]
C85  8.2pF  [CAP - 0603]
C86  1uF  [A]
C87  100nF  [CAP - 0402]
C88  100nF  [CAP - 0402]
C89  100nF  [CAP - 0402]
C90  100nF  [CAP - 0402]
C91  100nF  [CAP - 0402]
C92  100nF  [CAP - 0402]
C93  3.0pF  [CAP - 0603]
C94  3.0pF  [CAP - 0603]
C95  100nF  [CAP - 0402]
C96  2.2uF  [CAP - 0402]
C98  4.7uF  [A]
L5  BEAD(FCM1608KF-601T03)  [1608[0603]]
R24  4K7  [RES - 0402]  (value not drawn)
R25  4K7  [RES - 0402]  (value not drawn)
R122  10K  [RES - 0402]
R123  0  [RES - 0402]
R131  0  [RES - 0402]
R132  0  [RES - 0402]
R133  0  [RES - 0402]
R149  10K  [RES - 0402]
TP8  BOOT0  [PIN HEADER 1p]  (no BOM)
TP9  +3V3  [PIN HEADER 1p]  (no BOM)
U14  STM32F469NIH6  [STM-TFBGA216]  (parts A,B,C of 3)
X2  NX3225GD-8.00M  [RESC3226X100N]
X3  NX3215SA-32.768K  [NX3215SA]

### Ports
A[0..11] (out), A[14..15] (out), BATMS (in), BATMS_EN (bidir), ButtonFree, CAM_PWDN (out), CAM_RST (out), D[0..31] (bidir), DSI_CK_N (out), DSI_CK_P (out), DSI_D0_N (bidir), DSI_D0_P (bidir), DSI_D1_N (bidir), DSI_D1_P (bidir), DSI_TE (in), FMC_NBL0 (out), FMC_NBL1 (out), FMC_NBL2 (out), FMC_NBL3 (out), HREF (bidir), I2C1_SCL (out), I2C1_SDA (bidir), LCD_BL_CTRL, LCD_INT (in), LCD_RST (out), LED1 (bidir), MICROAB_N, MICROAB_P, NRST (bidir), PCLK (bidir), POWER_GOOD (bidir), QSPI_BK1_IO0 (bidir), QSPI_BK1_IO1 (bidir), QSPI_BK1_IO2 (bidir), QSPI_BK1_IO3 (bidir), QSPI_BK1_NCS (out), QSPI_CLK (out), SDCKE0 (out), SDCLK (out), SDNCAS (out), SDNE0 (out), SDNRAS (out), SDNWE (out), SIO_CLK (out), SIO_DAT (bidir), SPI2_MISO (in), SPI2_MOSI (out), SPI2_NSS (out), SPI2_SCK (out), STBC_CEN (in), STBC_CHG (bidir), STBC_SD (in), STBC_WAKEUP (bidir), SWCLK (in), SWDIO, SWO (out), USB_FS1_ID (in), VIBRATION_MOTOR (out), VSYNC (out), XCLK (out), Y0 (bidir), Y1 (bidir), Y2 (bidir), Y3 (out), Y4 (out), Y5 (bidir), Y6 (out), Y7 (out), Y8 (bidir), Y9 (bidir)

### Nets
+3V3: C53.1 C54.1 C60.1 C67.1 C68.1 C69.1 C70.1 C71.1 C72.1 C73.1 C74.1 C75.1 C84.1 C88.1 C89.1 C90.1 C91.1 C92.1 C95.1 C98.1 L5.1 R24.1 R25.1 R149.2 TP9.1 U14.C1(VBAT) U14.E7(VDD3) U14.E8(VDD11) U14.E9(VDD10) U14.E10(VDD15) U14.F4(VDD13) U14.F5(VDD17) U14.F11(VDD2) U14.G5(VDD18) U14.G11(VDD_USB33) U14.H5(VDD5) U14.H11(VDD_VREGDSI) U14.J5(VDD12) U14.J11(VDD8) U14.K5(VDD4) U14.K11(VDD14) U14.L7(VDD19) U14.L8(VDD6) U14.L9(VDD7) U14.L10(VDD1)  [also labelled VDD_MCU]
DSI_VDD12: C81.1 C86.1 C87.2 U14.G13(DSI_VDD12) U14.K12(DSI_VCAP)
GND: C53.2 C54.2 C60.2 C65.2 C67.2 C68.2 C69.2 C70.2 C71.2 C72.2 C73.2 C74.2 C75.2 C76.2 C77.1 C78.1 C80.2 C81.2 C83.2 C84.2 C85.2 C86.2 C87.1 C88.2 C89.2 C90.2 C91.2 C92.2 C93.2 C94.2 C95.2 C96.2 C98.2 R122.1 U14.F2(VSS13_VSS18) U14.F6(VSS3) U14.F7(VSS11) U14.F8(VSS10) U14.F9(VSS15) U14.F10(VSS2) U14.G6(VSS17) U14.G10(VSS9) U14.G12(DSI_VSS) U14.H6(VSS5) U14.H10(VSS20) U14.J6(VSS12) U14.J10(VSS8) U14.K6(VSS4) U14.K7(VSS6) U14.K8(VSS7) U14.K9(VSS1) U14.K10(VSS14) U14.L6(VSS19) U14.M1(VSSA) U14.N1(VREF-)
VBUS_FS1: U14.E15(PA9)
VDDA: C65.1 C77.2 L5.2 R123.1 U14.R1(VDDA)
VREF+: C78.2 C80.1 R123.2 U14.P1(VREF+)
A0: U14.D2(PF0)  [also labelled PF0]
A1: U14.E2(PF1)  [also labelled PF1]
A2: U14.G2(PF2)  [also labelled PF2]
A3: U14.H2(PF3)  [also labelled PF3]
A4: U14.J2(PF4)  [also labelled PF4]
A5: U14.K3(PF5)  [also labelled PF5]
A6: U14.M6(PF12)  [also labelled PF12]
A7: U14.N6(PF13)  [also labelled PF13]
A8: U14.P6(PF14)  [also labelled PF14]
A9: U14.M8(PF15)  [also labelled PF15]
A10: U14.N7(PG0)  [also labelled PG0]
A11: U14.M7(PG1)  [also labelled PG1]
A14: U14.N12(PG4)  [also labelled PG4]
A15: U14.N11(PG5)  [also labelled PG5]
BATMS: U14.A8(PB5) ; port BATMS
BATMS_EN: U14.B10(PJ12) ; port BATMS_EN
BOOT0: TP8.1 U14.E6(BOOT0)
CAM_PWDN: U14.P5(PC5) ; port CAM_PWDN
CAM_RST: U14.N5(PC4) ; port CAM_RST
D0: U14.L12(PD14)  [also labelled PD14]
D1: U14.K13(PD15)  [also labelled PD15]
D2: U14.B12(PD0)
D3: U14.C12(PD1)
D4: U14.R8(PE7)  [also labelled PE7]
D5: U14.N9(PE8)  [also labelled PE8]
D6: U14.P9(PE9)  [also labelled PE9]
D7: U14.R9(PE10)  [also labelled PE10]
D8: U14.P10(PE11)  [also labelled PE11]
D9: U14.R10(PE12)  [also labelled PE12]
D10: U14.R12(PE13)  [also labelled PE13]
D11: U14.P11(PE14)  [also labelled PE14]
D12: U14.R11(PE15)  [also labelled PE15]
D13: U14.L15(PD8)  [also labelled PD8]
D14: U14.L14(PD9)  [also labelled PD9]
D15: U14.K15(PD10)  [also labelled PD10]
D16: U14.P14(PH8)  [also labelled PH8]
D17: U14.N14(PH9)  [also labelled PH9]
D18: U14.P15(PH10)  [also labelled PH10]
D19: U14.N15(PH11)  [also labelled PH11]
D20: U14.M15(PH12)  [also labelled PH12]
D21: U14.E12(PH13)  [also labelled PH13]
D22: U14.E13(PH14)  [also labelled PH14]
D23: U14.D13(PH15)  [also labelled PH15]
D24: U14.E14(PI0)  [also labelled PI0]
D25: U14.D14(PI1)  [also labelled PI1]
D26: U14.C14(PI2)  [also labelled PI2]
D27: U14.C13(PI3)  [also labelled PI3]
D28: U14.D6(PI6)  [also labelled PI6]
D29: U14.D4(PI7)  [also labelled PI7]
D30: U14.E4(PI9)  [also labelled PI9]
D31: U14.D5(PI10)  [also labelled PI10]
DSI_CK_N: U14.H13(DSI_CK_N) ; port DSI_CK_N
DSI_CK_P: U14.H12(DSI_CK_P) ; port DSI_CK_P
DSI_D0_N: U14.J13(DSI_D0_N) ; port DSI_D0_N
DSI_D0_P: U14.J12(DSI_D0_P) ; port DSI_D0_P
DSI_D1_N: U14.F13(DSI_D1_N) ; port DSI_D1_N
DSI_D1_P: U14.F12(DSI_D1_P) ; port DSI_D1_P
DSI_TE: U14.P7(PJ2) ; port DSI_TE
HREF: U14.N4(PA4) ; port HREF
I2C1_SCL: U14.A7(PB8) ; port I2C1_SCL
I2C2_SDA: U14.B4(PB9) ; port I2C1_SDA  [project net I2C1_SDA]
LCD_BL_CTRL: U14.R14(PB14) ; port LCD_BL_CTRL
LCD_INT: U14.M14(PJ5) ; port LCD_INT
LCD_RST: U14.N13(PH7) ; port LCD_RST
LED1: U14.R15(PB15) ; port LED1
MICROAB_N: U14.C15(PA11) ; port MICROAB_N
MICROAB_P: U14.B15(PA12) ; port MICROAB_P
NRST: U14.J1(NRST) ; port NRST
PB6: U14.B6(PB6) ; port QSPI_BK1_NCS
PC0: U14.M2(PC0) ; port SDNWE
PC14: R132.2 U14.E1(PC14-OSC32_IN)
PC15: R133.2 U14.F1(PC15-OSC32_OUT)
PCLK: U14.P3(PA6) ; port PCLK
PE0: U14.A6(PE0) ; port FMC_NBL0
PE1: U14.A5(PE1) ; port FMC_NBL1
PF6: U14.K2(PF6) ; port QSPI_BK1_IO3
PF7: U14.K1(PF7) ; port QSPI_BK1_IO2
PF8: U14.L3(PF8) ; port QSPI_BK1_IO0
PF9: U14.L2(PF9) ; port QSPI_BK1_IO1
PF10: U14.L1(PF10) ; port QSPI_CLK
PF11: U14.P8(PF11) ; port SDNRAS
PG15: U14.B7(PG15) ; port SDNCAS
PH0: R131.1 U14.G1(PH0-OSC_IN)
PH1: C83.1 U14.H1(PH1-OSC_OUT) X2.1(OSC1)
PH2: U14.K4(PH2) ; port SDCKE0
PH3: U14.J4(PH3) ; port SDNE0
PI4: U14.C3(PI4) ; port FMC_NBL2
PI5: U14.D3(PI5) ; port FMC_NBL3
POWER_GOOD: U14.B13(PC11) ; port POWER_GOOD
SIO_CLK: R25.2 U14.H4(PH4) ; port SIO_CLK
SIO_DAT: R24.2 U14.J3(PH5) ; port SIO_DAT
SPI2_MISO: U14.M4(PC2) ; port SPI2_MISO
SPI2_MOSI: U14.M3(PC1) ; port SPI2_MOSI
SPI2_NSS: U14.L13(PB12) ; port SPI2_NSS
SPI2_SCK: U14.P12(PB10) ; port SPI2_SCK
STBC_CEN: U14.A11(PD7) ; port STBC_CEN
STBC_CHG: U14.A9(PB4) ; port STBC_CHG
STBC_SD: U14.B9(PJ13) ; port STBC_SD
STBC_WAKEUP: U14.B14(PC10) ; port STBC_WAKEUP
SWCLK: U14.A14(PA14) ; port SWCLK
SWDIO: U14.A15(PA13) ; port SWDIO
VIBRATION_MOTOR: U14.A13(PA15) ; port VIBRATION_MOTOR
VSYNC: U14.D9(PG9) ; port VSYNC
XCLK: U14.F15(PA8) ; port XCLK
Y0: U14.H15(PC6) ; port Y0
Y1: U14.G15(PC7) ; port Y1
Y2: U14.G14(PC8) ; port Y2
Y3: U14.B8(PG11) ; port Y3
Y4: U14.A1(PE4) ; port Y4
Y5: U14.C11(PD3) ; port Y5
Y6: U14.B1(PE5) ; port Y6
Y7: U14.B2(PE6) ; port Y7
Y8: U14.P13(PH6) ; port Y8
Y9: U14.A12(PC12) ; port Y9
NetC76_1: C76.1 U14.L11(VCAP1)
NetC85_1: C85.1 R131.2 X2.2(OSC2)
NetC93_1: C93.1 R132.1 X3.1
NetC94_1: C94.1 R133.1 X3.2
NetC96_1: C96.1 U14.E11(VCAP2)
NetCN1_1: U14.A10(PB3) ; port SWO
NetR8_2: U14.R5(PB0) ; port ButtonFree
NetR122_2: R122.2 U14.L5(BYPASS-REG)
NetR149_1: R149.1 U14.E5(PDR_ON)
NetR161_2: U14.D15(PA10) ; port USB_FS1_ID
NetU4_J1: U14.H14(PG8) ; port SDCLK

Not connected (* = marked no-connect by the designer): U14 A2(PE3)* A3(PE2)* A4(PG14)* B3(PG13)* B5(PB7)* B11(PD6)* C2(PI8-ANTI_TAMP2)* C4(PK7)* C5(PK6)* C6(PK5)* C7(PG12)* C8(PG10)* C9(PJ14)* C10(PD5)* D1(PC13-ANTI_TAMP)* D7(PK4)* D8(PK3)* D10(PJ15)* D11(PD4)* D12(PD2)* E3(PI12)* F3(PI11)* F14(PC9)* G3(PI13)* G4(PI15)* H3(PI14)* J14(PG7)* J15(PG6)* K14(PB13)* L4(PC3)* M5(PB2)* M9(PJ4)* M10(PD12)* M11(PD13)* M12(PG3)* M13(PG2)* N2(PA1)* N3(PA0-WKUP)* N8(PJ3)* N10(PD11)* P2(PA2)* P4(PA5)* R2(PA3)* R3(PA7)* R4(PB1)* R6(PJ0)* R7(PJ1)* R13(PB11)*

### Buses and harness runs
bus A[0..11] = port A[0..11]
bus A[14..15] = port A[14..15]
bus D[0..31] = port D[0..31]

### Notes on the sheet
- R87 and R135 are for reserved use
- Close to MCU
- close to MCU
- Ceramic capacitor (Low ESR)
- Title:
- Project:
- Size:
- Date:
- A3
- Reference:
- Sheet:
- Revision:
- of

### Library data of the parts
C53 C54 C67-C75 C83-C85 C88-C95 = CAP: Capacitor; Ordered by: Subcon
  C53 C54 C67-C75 C84 C88-C92 C95: Published: 8-Jun-2000; Revision: July-2002: Re-released for DXP Platform.; Publisher: Altium Limited; Value: 100nF
C60 C98 = Cap Pol1: Polarized Capacitor (Radial); Value: 47uF; Ordered by: Subcon; Published: 8-Jun-2000; Revision: July-2002: Re-released for DXP Platform.; Publisher: Altium Limited
C65 C80 C86 = Cap Pol1: Polarized Capacitor (Radial); Value: 10uF; Ordered by: Subcon; Published: 8-Jun-2000; Revision: July-2002: Re-released for DXP Platform.; Publisher: Altium Limited
C76-C78 C81 C87 C96 = Cap: as C42 on sheet Memory; Published: 8-Jun-2000; Revision: July-2002: Re-released for DXP Platform.; Publisher: Altium Limited
L5 = Inductor: Value: 100uH; Ordered by: Subcon; Published: 8-Jun-2000; Revision: July-2002: Re-released for DXP Platform.; Publisher: Altium Limited
R24 R25 R122 R123 R131-R133 R149 = Res1: Resistor; Value: 1K; Ordered by: Subcon; Published: 8-Jun-2000; Revision: July-2002: Re-released for DXP Platform.; Publisher: Altium Limited
TP8 TP9 = TestPin
U14 = Manta_Dragon_TFBGA216: Manuf_Part_1: STM32F469NIH6U cut 1.0; Ordered by: ST; Ref St: 9175177; ECCN_US/EU: 3A991A2/NEC; Manuf_1: ST
X2 = XTAL_8M_NX3225GD: Crystal 8Mhz, 8pF, -+50PPM, SMD; Manuf_1: NDK; Manuf_Part_1: NX3225GD 8MHz EXS00A-CG04874; Manuf_Part_2: NX3225GD-8.000M-STD-CRA-3; ECCN_US/EU: EAR99/NEC; NDK Ref: X3127326; Ref St: 9157029; Provided: ST; Order: NX3225GD 8MHz EXS00A-CG04874; Ordered by: ST
X3 = XTAL_32K_NX3215SA: Crystal 32.768kHz, 6pF, -+20PPM, R=50K, SMD; Manuf_1: NDK; Manuf_Part_1: NX3215SA 32.768KHz EXS00A-MU00525; ECCN_US/EU: EAR99/NEC; Ref St: 9157034; NDK Ref: X3101802; Provided: ST; Distrib: *; Order: NX3215SA 32.768KHz EXS00A-MU00525; Ordered by: ST

## Sheet DSI_LCD.SchDoc: 4 inch DSI LCD board
size A4; Date: 9/24/2014; Author: P.A.; CompanyName: STMicroelectronics; Organization: Microcontrollers Division; Address1: 12, Rue Jules HOROWITZ; Address2: 38019 Grenoble; Address3: FRANCE; DocumentNumber: MB1189; Revision: B-07; SheetNumber: 7; SheetTotal: 12; Project: STM32F469I-DISCO
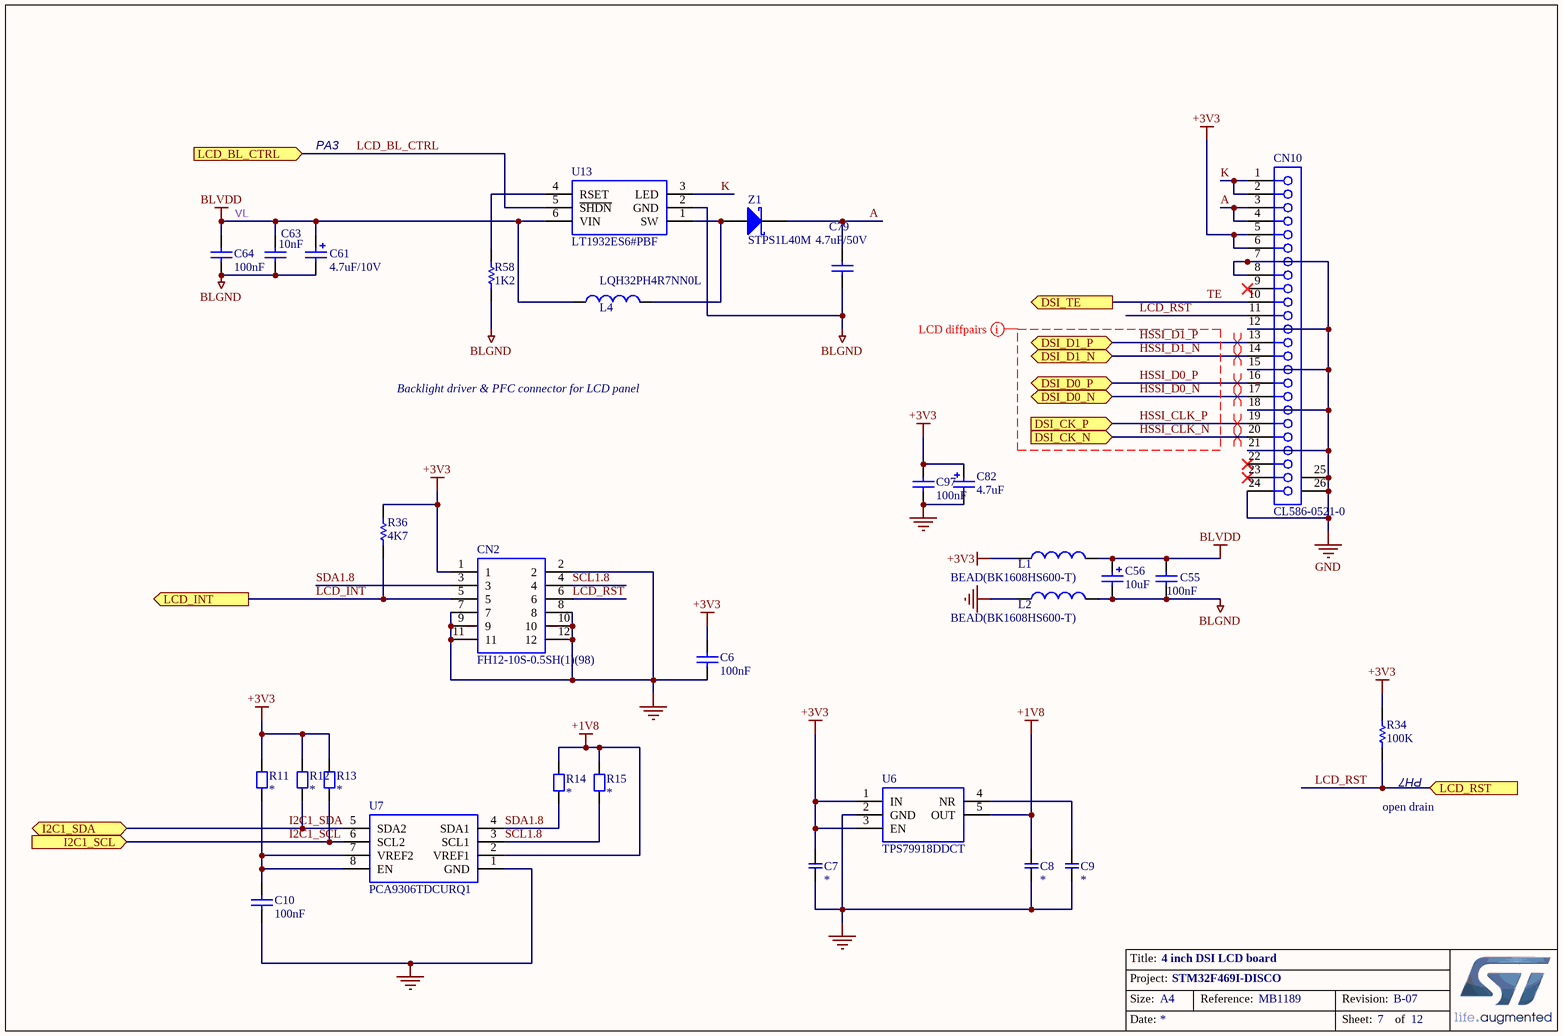
[diagram p5: DSI_LCD.SchDoc]

### Parts
C6  100nF  [CAP - 0402]
C7  100nF  [CAP - 0402]  (value not drawn)
C8  2.2uF  [CAP - 0402]  (value not drawn)
C9  10uF  [CAP - 0402]  (value not drawn)
C10  100nF  [CAP - 0402]
C55  100nF  [CAP - 0402]
C56  10uF  [A]
C61  4.7uF/10V  [CAP - 1206]
C63  10nF  [CAP - 0402]
C64  100nF  [CAP - 0402]
C79  4.7uF/50V  [CAP - 1206]
C82  4.7uF  [A]
C97  100nF  [CAP - 0402]
CN2  FH12-10S-0.5SH(1)(98)  [FH1210S05SH198]
CN10  CL586-0521-0  [FH12-24S-0.5SH]
L1  BEAD(BK1608HS600-T)  [1608[0603]]
L2  BEAD(BK1608HS600-T)  [1608[0603]]
L4  LQH32PH4R7NN0L  [C1210_L]
R11  200K  [RES - 0402]  (value not drawn)
R12  2K7  [RES - 0402]  (value not drawn)
R13  2K7  [RES - 0402]  (value not drawn)
R14  1K5  [RES - 0402]  (value not drawn)
R15  1K5  [RES - 0402]  (value not drawn)
R34  100K  [RES - 0402]
R36  4K7  [RES - 0402]
R58  1K2  [RES - 0402]
U6  TPS79918DDCT  [SOT95P280X110-5N]
U7  PCA9306TDCURQ1  [SOP50P310X90-8N]
U13  LT1932ES6#PBF  [SOT95P280X145-6N]
Z1  STPS1L40M  [DO-216AA]

### Ports
DSI_CK_N (in), DSI_CK_P (in), DSI_D0_N (bidir), DSI_D0_P (bidir), DSI_D1_N (bidir), DSI_D1_P (bidir), DSI_TE (out), I2C1_SCL (in), I2C1_SDA (bidir), LCD_BL_CTRL (in), LCD_INT (out), LCD_RST (in)

### Nets
+1V8: C8.2 R14.2 R15.2 U6.5(OUT) U7.2(VREF1)
+3V3: C6.2 C7.2 C82.1 C97.2 CN2.1 CN10.5 CN10.6 L1.1 R11.2 R12.2 R13.2 R34.1 R36.1 U6.1(IN) U6.3(EN)
BLGND: C55.2 C56.2 C61.2 C63.1 C64.1 C79.2 L2.2 R58.1 U13.2(GND)
GND: C6.1 C7.1 C8.1 C9.1 C10.1 C82.2 C97.1 CN2.2 CN2.7 CN2.8 CN2.9 CN2.10 CN2.11 CN2.12 CN10.7 CN10.8 CN10.12 CN10.15 CN10.18 CN10.21 CN10.24 CN10.25(MH1) CN10.26(MH2) L2.1 U6.2(GND) U7.1(GND)
VL: C55.1 C56.1 C61.1 C63.2 C64.2 L1.2 L4.1 U13.6(VIN)  [also labelled BLVDD]
A: C79.1 CN10.3 CN10.4 Z1.2(K)
HSSI_CLK_N: CN10.20 ; port DSI_CK_N  [project net DSI_CK_N]
HSSI_CLK_P: CN10.19 ; port DSI_CK_P  [project net DSI_CK_P]
HSSI_D0_N: CN10.17 ; port DSI_D0_N  [project net DSI_D0_N]
HSSI_D0_P: CN10.16 ; port DSI_D0_P  [project net DSI_D0_P]
HSSI_D1_N: CN10.14 ; port DSI_D1_N  [project net DSI_D1_N]
HSSI_D1_P: CN10.13 ; port DSI_D1_P  [project net DSI_D1_P]
I2C1_SCL: R13.1 U7.6(SCL2) ; port I2C1_SCL
I2C1_SDA: R12.1 U7.5(SDA2) ; port I2C1_SDA
K: CN10.1 CN10.2 U13.3(LED)
LCD_BL_CTRL: U13.5(~{SHDN}) ; port LCD_BL_CTRL
LCD_INT: CN2.5 R36.2 ; port LCD_INT
LCD_RST: CN2.6 CN10.11 R34.2 ; port LCD_RST
SCL1.8: CN2.4 R15.1 U7.3(SCL1)
SDA1.8: CN2.3 R14.1 U7.4(SDA1)
TE: CN10.10 ; port DSI_TE  [project net DSI_TE]
NetC9_2: C9.2 U6.4(NR)
NetC10_2: C10.2 R11.1 U7.7(VREF2) U7.8(EN)
NetL4_2: L4.2 U13.1(SW) Z1.1(A)
NetR58_2: R58.2 U13.4(RSET)

Not connected (* = marked no-connect by the designer): CN10 9* 22* 23*

### Layout directives
differential pair: DSI_CK_N, DSI_CK_P, DSI_D0_N, DSI_D0_P, DSI_D1_N, DSI_D1_P
net class LCD: HSSI_CLK_N, HSSI_CLK_P, HSSI_D0_N, HSSI_D0_P, HSSI_D1_N, HSSI_D1_P

### Notes on the sheet
- PA3
- Backlight driver & PFC connector for LCD panel
- (near R34) PH7
- open drain
- Title:
- Project:
- Size:
- Date:
- A4
- Reference:
- Sheet:
- Revision:
- of

### Library data of the parts
C6 C10 C63 C64 C79 C97 = CAP: Capacitor; Value: 100pF; Ordered by: Subcon; Published: 8-Jun-2000; Revision: July-2002: Re-released for DXP Platform.; Publisher: Altium Limited
C7-C9 = capacitor: Parameter 1: *; Parameter 2: *; Value: *
C55 = Cap: as C42 on sheet Memory; Published: 8-Jun-2000; Revision: July-2002: Re-released for DXP Platform.; Publisher: Altium Limited
C56 = Cap Pol1: as C24 on sheet Power; Published: 8-Jun-2000; Revision: July-2002: Re-released for DXP Platform.; Publisher: Altium Limited; Value: 10uF
C61 C82 = Cap Pol1: Polarized Capacitor (Radial); Value: 100pF; Ordered by: Subcon; Published: 8-Jun-2000; Revision: July-2002: Re-released for DXP Platform.; Publisher: Altium Limited
CN2 = FH12-10S-0.5SH(1)(98): FFC & FPC Connectors 10P SMT HORIZONTAL .5MM PITCH; Manufacturer_Name: Hirose; Geometry.Height: 2mm; Manufacturer_Part_Number: FH12-10S-0.5SH(1)(98); RS Part Number: *; RS Price/Stock: *; Arrow Part Number: FH12-10S-0.5SH(1)(98); Arrow Price/Stock: *; Datasheet Link: https://www.hirose.com/product/en/download_file/key_name/FH12-10S-0.5SH%281%29%2898%29/category/Drawing%20(2D)/doc_file_id/144497/?file_category_id=6&item_id=05280003598&is_series=
CN10 = CL586-0521-0: FH12 Series, "Flip-Lock" SMT/ZIF FFC/FPC Connector - 0.5mm Spaced Bottom Contact; Positions: 24; ContactMaterial: Phosphor Bronze; Current: 0.4A; PCB_Layout: Complies with manufacturer's recommendation.; Published: 17-Jul-2002; DatasheetVersion: 13-Nov-2000; PackageVersion: 13-Nov-2000; PackageReference: FH12-24S-0.5SH; Publisher: Altium Limited; PadDimensions: Follow nominal values, Suitable for Wave Soldering, Adjust for Re-flow.; ComponentLink1Description: Manufacturer Link; ComponentLink1URL: http://www.hiroseusa.com/; ComponentLink2Description: Datasheet; ComponentLink2URL: http://www.hirose.co.jp/cataloge_hp/e58605370.pdf
L1 L2 L4 = Inductor: Value: 100uH; Ordered by: Subcon; Published: 8-Jun-2000; Revision: July-2002: Re-released for DXP Platform.; Publisher: Altium Limited
R11-R15 = resistor: Parameter 1: *; Parameter 2: *; Value: *
R34 R36 R58 = Res1: Resistor; Value: 1K; Ordered by: Subcon; Published: 8-Jun-2000; Revision: July-2002: Re-released for DXP Platform.; Publisher: Altium Limited
U6 = TPS79918DDCT: TPS79918DDCT, Low Dropout Voltage Regulator, 0.2A, 1.8V 1%, 2.7 to 6.5Vin, 5-Pin SOT; Manufacturer_Name: Texas Instruments; Geometry.Height: 1.1mm; Manufacturer_Part_Number: TPS79918DDCT; RS Part Number: 1455973; RS Price/Stock: http://uk.rs-online.com/web/p/products/1455973; Mouser Part Number: 595-TPS79918DDCT; Mouser Price/Stock: https://www.mouser.com/Search/Refine.aspx?Keyword=595-TPS79918DDCT; Datasheet Link: http://www.ti.com/lit/ds/symlink/tps79918.pdf
U7 = PCA9306TDCURQ1: Automotive Dual Bidirectional I2C Bus and SMBus Voltage-Level Translator; Manufacturer_Name: Texas Instruments; Geometry.Height: 0.9mm; Manufacturer_Part_Number: PCA9306TDCURQ1; RS Part Number: *; RS Price/Stock: *; Mouser Part Number: 595-PCA9306TDCURQ1; Mouser Price/Stock: https://www.mouser.com/Search/Refine.aspx?Keyword=595-PCA9306TDCURQ1; Datasheet Link: http://www.ti.com/lit/gpn/pca9306-q1
U13 = LT1932ES6#PBF: LINEAR TECHNOLOGY - LT1932ES6#PBF - IC, DC/DC CONVERT/LED DR, 6SOT2; Geometry.Height: 1.45mm; Manufacturer_Name: Linear Technology; Manufacturer_Part_Number: LT1932ES6#PBF; RS Part Number: *; RS Price/Stock: *; Mouser Part Number: 584-LT1932ES6#PBF; Mouser Price/Stock: https://www.mouser.com/Search/Refine.aspx?Keyword=584-LT1932ES6%23PBF; Datasheet Link: http://www.linear.com/docs/2139
Z1 = D Schottky: Schottky Diode; Code - JEDEC: DO-214-AA; Ordered by: ST; Ref St: 9151085; ECCN_US/EU: EAR99/NEC; Published: 8-Jun-2000; Revision: July-2002: Re-released for DXP Platform.; Publisher: Altium Limited; Manuf_1: ST; Manuf_Part_1: STPS1L40M

## Sheet QSPI.SchDoc: QSPI
size A4; Date: 9/24/2014; Author: P.A.; CompanyName: STMicroelectronics; Organization: Microcontrollers Division; Address1: 12, Rue Jules HOROWITZ; Address2: 38019 Grenoble; Address3: FRANCE; DocumentNumber: MB1189; Revision: B-07; SheetNumber: 9; SheetTotal: 12; Project: STM32F469I-DISCO
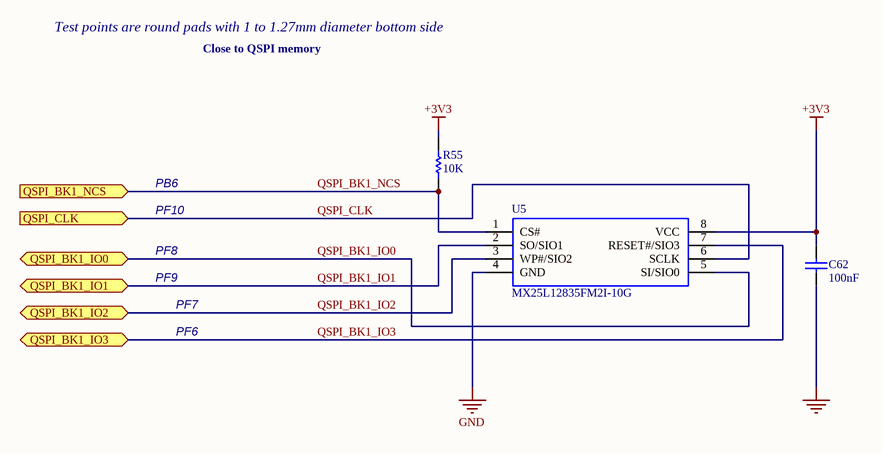
[diagram p6: QSPI.SchDoc]

### Parts
C62  100nF  [CAP - 0402]
R55  10K  [RES - 0402]
U5  MX25L12835FM2I-10G  [SOIC127P790X216-8N]

### Ports
QSPI_BK1_IO0 (bidir), QSPI_BK1_IO1 (bidir), QSPI_BK1_IO2 (bidir), QSPI_BK1_IO3 (bidir), QSPI_BK1_NCS (in), QSPI_CLK (in)

### Nets
+3V3: C62.1 R55.2 U5.8(VCC)
GND: C62.2 U5.4(GND)
QSPI_BK1_IO0: U5.5(SI/SIO0) ; port QSPI_BK1_IO0  [project net PF8]
QSPI_BK1_IO1: U5.2(SO/SIO1) ; port QSPI_BK1_IO1  [project net PF9]
QSPI_BK1_IO2: U5.3(WP#/SIO2) ; port QSPI_BK1_IO2  [project net PF7]
QSPI_BK1_IO3: U5.7(RESET#/SIO3) ; port QSPI_BK1_IO3  [project net PF6]
QSPI_BK1_NCS: R55.1 U5.1(CS#) ; port QSPI_BK1_NCS  [project net PB6]
QSPI_CLK: U5.6(SCLK) ; port QSPI_CLK  [project net PF10]

### Notes on the sheet
- Test points are round pads with 1 to 1.27mm diameter bottom side
- Close to QSPI memory
- PB6
- PF10
- PF8
- PF9
- PF7
- PF6
- Title:
- Project:
- Size:
- Date:
- A4
- Reference:
- Sheet:
- Revision:
- of

### Library data of the parts
C62 = Cap: as C42 on sheet Memory; Published: 8-Jun-2000; Revision: July-2002: Re-released for DXP Platform.; Publisher: Altium Limited
R55 = Res_10K_1%_0402: Resistor; Manuf_Part_1: RC0402FR-0710KL; Manuf_1: YAGEO; Ordered by: Subcon; Value: 10K; Order: RC0402FR-0710KL; ECCN_US/EU: n/a
U5 = MX25L12835FM2I-10G: Macronix MX25L12835FM2I-10G 128Mbit Flash Memory; 3V, SOP, 8-Pin; Geometry.Height: 2.16mm; Manufacturer_Name: Macronix; Manufacturer_Part_Number: MX25L12835FM2I-10G; RS Part Number: 1703072; RS Price/Stock: http://uk.rs-online.com/web/p/products/1703072; Arrow Part Number: MX25L12835FM2I-10G; Arrow Price/Stock: https://www.arrow.com/en/products/mx25l12835fm2i-10g/macronix-international; Datasheet Link: http://www.macronix.com/Lists/Datasheet/Attachments/6710/MX25L12835F,%203V,%20128Mb,%20v1.6.pdf

## Sheet USB_OTG_FS.SchDoc: USB_OTG_FS
size A4; Date: 9/24/2014; Author: P.A.; CompanyName: STMicroelectronics; Organization: Microcontrollers Division; Address1: 12, Rue Jules HOROWITZ; Address2: 38019 Grenoble; Address3: FRANCE; DocumentNumber: MB1189; Revision: B-07; SheetNumber: 10; SheetTotal: 12; Project: STM32F469I-DISCO
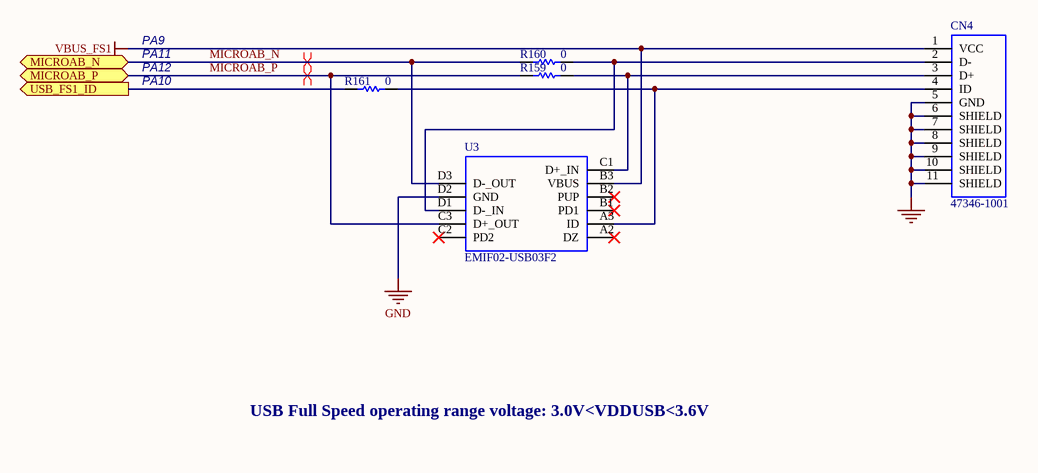
[diagram p7: USB_OTG_FS.SchDoc]

### Parts
CN4  47346-1001  [47346-0001]
R159  0  [RES - 0402]
R160  0  [RES - 0402]
R161  0  [RES - 0402]
U3  EMIF02-USB03F2  [BGA11C50P3X4_144X194X72]

### Ports
MICROAB_N (bidir), MICROAB_P (bidir), USB_FS1_ID (out)

### Nets
GND: CN4.5(GND) CN4.6(SHIELD) CN4.7(SHIELD) CN4.8(SHIELD) CN4.9(SHIELD) CN4.10(SHIELD) CN4.11(SHIELD) U3.D2(GND)
VBUS_FS1: CN4.1(VCC) U3.B3(VBUS)
MICROAB_N: R160.2 U3.D3(D-_OUT) ; port MICROAB_N
MICROAB_P: R159.2 U3.C3(D+_OUT) ; port MICROAB_P
NetCN4_2: CN4.2(D-) R160.1 U3.D1(D-_IN)
NetCN4_3: CN4.3(D+) R159.1 U3.C1(D+_IN)
NetCN4_4: CN4.4(ID) R161.1 U3.A3(ID)
NetR161_2: R161.2 ; port USB_FS1_ID

Not connected (* = marked no-connect by the designer): U3 A2(DZ)* B1(PD1)* B2(PUP)* C2(PD2)*

### Layout directives
differential pair: MICROAB_N, MICROAB_P

### Notes on the sheet
- PA9
- PA10
- PA11
- PA12
- USB Full Speed operating range voltage: 3.0V<VDDUSB<3.6V
- Title:
- Project:
- Size:
- Date:
- A4
- Reference:
- Sheet:
- Revision:
- of

### Library data of the parts
CN4 = 47346-1001: MOLEX - 47346-1001 - MULTIPOLE CONNECTOR; Manufacturer_Name: Molex; Manufacturer_Part_Number: 47346-1001; RS Part Number: *; RS Price/Stock: *; Mouser Part Number: 538-47346-1001; Mouser Price/Stock: https://www.mouser.com/Search/Refine.aspx?Keyword=538-47346-1001; Datasheet Link: http://www.molex.com/webdocs/datasheets/pdf/en-us/0473461001_IO_CONNECTORS.pdf
R159-R161 = Res1: Resistor; Value: 1K; Ordered by: Subcon; Published: 8-Jun-2000; Revision: July-2002: Re-released for DXP Platform.; Publisher: Altium Limited
U3 = EMIF02-USB03F2: New STMicroelectronics EMIF02-USB03F2 EMI Filter & ESD Protector; Geometry.Height: 0.715mm; Manufacturer_Name: STMicroelectronics; Manufacturer_Part_Number: EMIF02-USB03F2; RS Part Number: 1658173; RS Price/Stock: http://uk.rs-online.com/web/p/products/1658173; Arrow Part Number: EMIF02-USB03F2; Arrow Price/Stock: https://www.arrow.com/en/products/emif02-usb03f2/stmicroelectronics; Datasheet Link: http://www.st.com/content/ccc/resource/technical/document/datasheet/0a/25/37/a6/28/ab/4f/24/CD00042880.pdf/files/CD00042880.pdf/jcr:content/translations/en.CD00042880.pdf